# Altium project c1-12.PrjPCB (part 1 of 3)
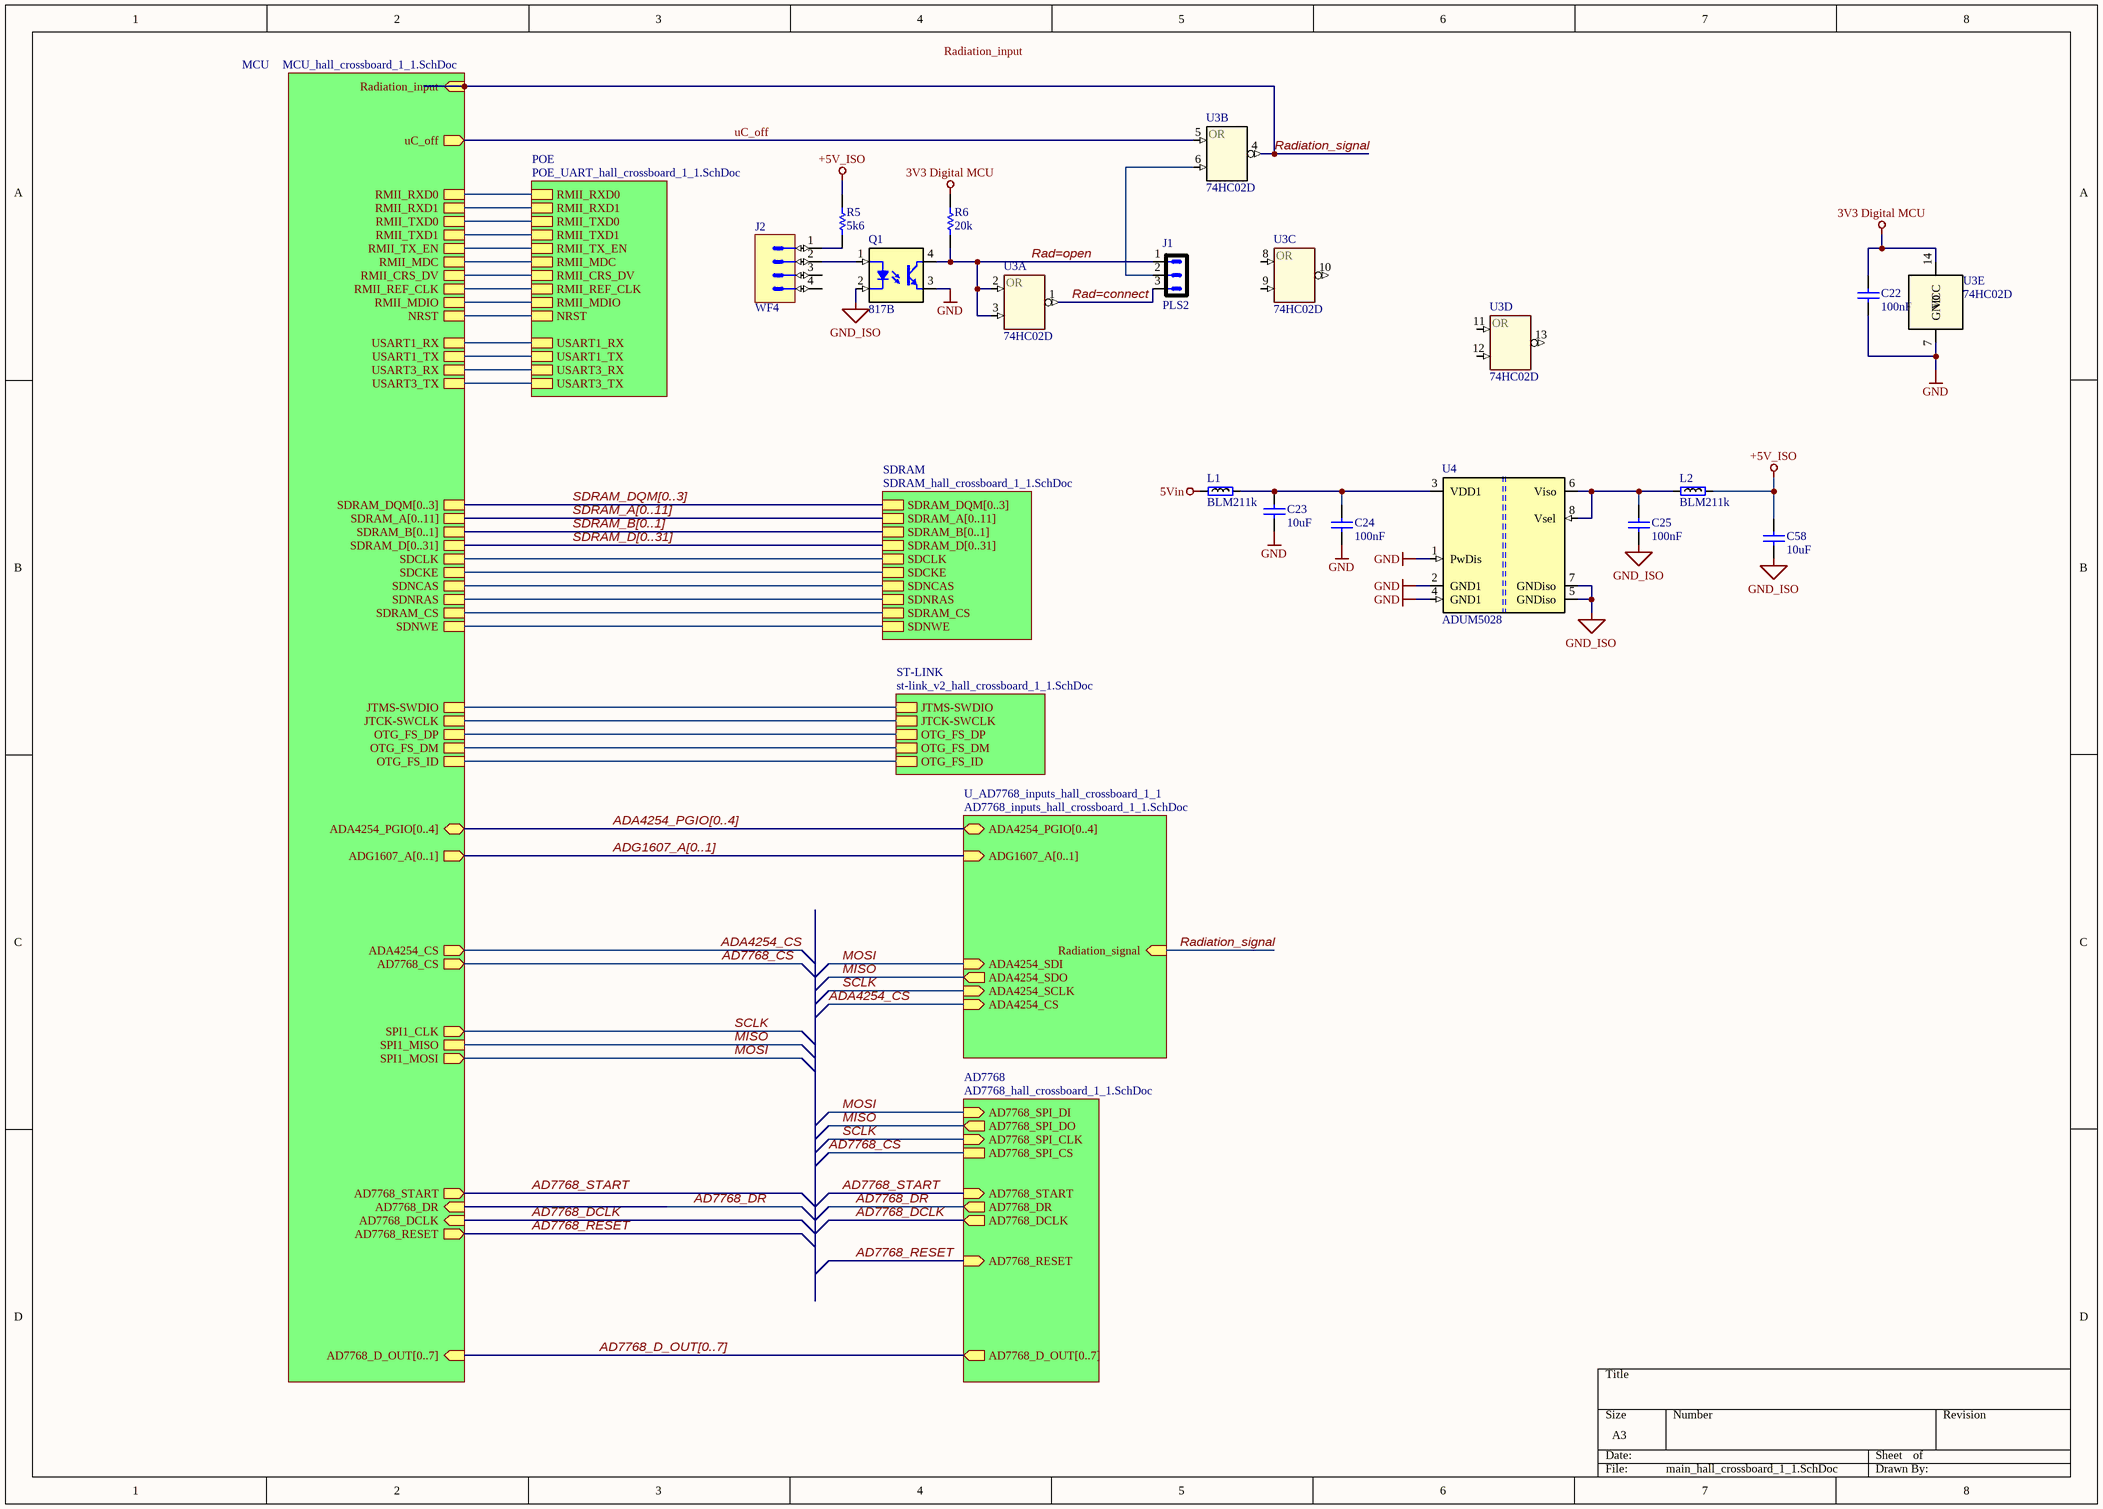
[diagram p0: main_hall_crossboard_1_1.SchDoc]
10 sheets, 646 parts. Net scope: hierarchical (ports join the sheet entries above them; power ports are global).
Board file: PCB_proj_module.PcbDoc
Sheets:
  main_hall_crossboard_1_1.SchDoc
    MCU = MCU_hall_crossboard_1_1.SchDoc
    POE = POE_UART_hall_crossboard_1_1.SchDoc
    AD7768 = AD7768_hall_crossboard_1_1.SchDoc
    ST-LINK = st-link_v2_hall_crossboard_1_1.SchDoc
    SDRAM = SDRAM_hall_crossboard_1_1.SchDoc
    U_AD7768_inputs_hall_crossboard_1_1 = AD7768_inputs_hall_crossboard_1_1.SchDoc
      meas_ch1 = one_planar_sensor_connector_hall_crossboard_1_1.SchDoc
        U_source_of_current_hall_crossboard_1_1 = source_of_current_hall_crossboard_1_1.SchDoc
      meas_ch2 = one_planar_sensor_connector_hall_crossboard_1_1.SchDoc
        U_source_of_current_hall_crossboard_1_1 = source_of_current_hall_crossboard_1_1.SchDoc
      meas_ch3 = one_planar_sensor_connector_hall_crossboard_1_1.SchDoc
        U_source_of_current_hall_crossboard_1_1 = source_of_current_hall_crossboard_1_1.SchDoc
      meas_ch4 = one_planar_sensor_connector_hall_crossboard_1_1.SchDoc
        U_source_of_current_hall_crossboard_1_1 = source_of_current_hall_crossboard_1_1.SchDoc
      meas_ch5 = one_planar_sensor_connector_hall_crossboard_1_1.SchDoc
        U_source_of_current_hall_crossboard_1_1 = source_of_current_hall_crossboard_1_1.SchDoc
      meas_ch6 = one_planar_sensor_connector_hall_crossboard_1_1.SchDoc
        U_source_of_current_hall_crossboard_1_1 = source_of_current_hall_crossboard_1_1.SchDoc
      meas_ch7 = one_planar_sensor_connector_hall_crossboard_1_1.SchDoc
        U_source_of_current_hall_crossboard_1_1 = source_of_current_hall_crossboard_1_1.SchDoc
      meas_ch8 = one_planar_sensor_connector_hall_crossboard_1_1.SchDoc
        U_source_of_current_hall_crossboard_1_1 = source_of_current_hall_crossboard_1_1.SchDoc
  power_hall_crossboard_1_1.SchDoc

## Sheet main_hall_crossboard_1_1.SchDoc
size A3

### Parts
C22  100nF  [0603C]
C23  10uF  [0805C]
C24  100nF  [0603C]
C25  100nF  [0603C]
C58  10uF  [0805C]
J1  PLS2  [COMATEL_385.0358.1.03.400]
J2  WF4  [WF4_2_54]
L1  BLM211k  [RESC2012X50N]
L2  BLM211k  [RESC2012X50N]
Q1  817B  [DIP4-300]
R5  5k6  [0603R]
R6  20k  [0603R]
U3  74HC02D  [SOIC127P600X175-14N]  (parts A,B,C,D,E of 5)
U4  ADUM5028  [SOIC127P600X175-8N]

### Sub-sheets
AD7768 = AD7768_hall_crossboard_1_1.SchDoc: AD7768_SPI_DI (in), AD7768_SPI_DO (out), AD7768_SPI_CLK (in), AD7768_SPI_CS, AD7768_DR (out), AD7768_RESET (in), AD7768_START (in), AD7768_DCLK (out), AD7768_D_OUT[0..7] (out)
MCU = MCU_hall_crossboard_1_1.SchDoc: RMII_RXD0, RMII_RXD1, RMII_TXD0, RMII_TXD1, RMII_TX_EN, RMII_MDC, RMII_CRS_DV, RMII_REF_CLK, RMII_MDIO, NRST, SPI1_CLK (out), SPI1_MISO, SPI1_MOSI (out), SDRAM_DQM[0..3], SDRAM_A[0..11], SDRAM_D[0..31], SDRAM_B[0..1], SDCLK, SDCKE, SDNCAS, SDNRAS, SDRAM_CS, SDNWE, USART1_RX, USART1_TX, USART3_RX, USART3_TX, JTMS-SWDIO, JTCK-SWCLK, OTG_FS_DP, OTG_FS_DM, OTG_FS_ID, Radiation_input (in), ADA4254_PGIO[0..4] (bidir), ADG1607_A[0..1] (out), ADA4254_CS (out), AD7768_CS (out), uC_off (out), AD7768_START (out), AD7768_DR (in), AD7768_DCLK (in), AD7768_RESET (out), AD7768_D_OUT[0..7] (in)
POE = POE_UART_hall_crossboard_1_1.SchDoc: RMII_RXD0, RMII_RXD1, RMII_TXD0, RMII_TXD1, RMII_TX_EN, RMII_MDC, RMII_CRS_DV, RMII_REF_CLK, RMII_MDIO, NRST, USART1_RX, USART1_TX, USART3_RX, USART3_TX
SDRAM = SDRAM_hall_crossboard_1_1.SchDoc: SDRAM_DQM[0..3], SDRAM_A[0..11], SDRAM_D[0..31], SDRAM_B[0..1], SDCLK, SDCKE, SDNCAS, SDNRAS, SDRAM_CS, SDNWE
ST-LINK = st-link_v2_hall_crossboard_1_1.SchDoc: JTMS-SWDIO, JTCK-SWCLK, OTG_FS_DP, OTG_FS_DM, OTG_FS_ID
U_AD7768_inputs_hall_crossboard_1_1 = AD7768_inputs_hall_crossboard_1_1.SchDoc: Radiation_signal (in), ADA4254_SDO (out), ADA4254_SDI (in), ADA4254_SCLK (in), ADA4254_CS (in), ADA4254_PGIO[0..4] (bidir), ADG1607_A[0..1] (in)

### Nets
3V3 Digital MCU: C22.2 R6.2 U3.14(VCC)
5Vin: L1.2
+5V_ISO: C58.2 L2.1 R5.2
GND: C22.1 C23.1 C24.1 Q1.3(E) U3.7(GND) U4.1(PwDis) U4.2(GND1) U4.4(GND1)  [project net Pt_100+]
GND_ISO: C25.1 C58.1 Q1.2(C) U4.5(GNDiso) U4.7(GNDiso)
AD7768_CS: sheet MCU/AD7768_CS, sheet AD7768/AD7768_SPI_CS
AD7768_DCLK: sheet MCU/AD7768_DCLK, sheet AD7768/AD7768_DCLK
AD7768_DR: sheet MCU/AD7768_DR, sheet AD7768/AD7768_DR
AD7768_RESET: sheet MCU/AD7768_RESET, sheet AD7768/AD7768_RESET
AD7768_START: sheet MCU/AD7768_START, sheet AD7768/AD7768_START
ADA4254_CS: sheet MCU/ADA4254_CS, sheet U_AD7768_inputs_hall_crossboard_1_1/ADA4254_CS
MISO: sheet MCU/SPI1_MISO, sheet AD7768/AD7768_SPI_DO, sheet U_AD7768_inputs_hall_crossboard_1_1/ADA4254_SDO
MOSI: sheet MCU/SPI1_MOSI, sheet AD7768/AD7768_SPI_DI, sheet U_AD7768_inputs_hall_crossboard_1_1/ADA4254_SDI
NRST: sheet MCU/NRST, sheet POE/NRST
Rad=connect: J1.3 U3.1(OUT)
Rad=open: J1.1 Q1.4(C) R6.1 U3.2(IN) U3.3(IN)
Radiation_signal: U3.4(OUT) ; sheet MCU/Radiation_input, sheet U_AD7768_inputs_hall_crossboard_1_1/Radiation_signal
SCLK: sheet MCU/SPI1_CLK, sheet AD7768/AD7768_SPI_CLK, sheet U_AD7768_inputs_hall_crossboard_1_1/ADA4254_SCLK
uC_off: U3.5(IN) ; sheet MCU/uC_off
NetC23_2: C23.2 C24.2 L1.1 U4.3(VDD1)
NetC25_2: C25.2 L2.2 U4.6(Viso) U4.8(Vsel)
NetCN1_2: sheet MCU/JTMS-SWDIO, sheet ST-LINK/JTMS-SWDIO
NetCN1_3: sheet MCU/JTCK-SWCLK, sheet ST-LINK/JTCK-SWCLK
NetCR2_1: sheet MCU/OTG_FS_DP, sheet ST-LINK/OTG_FS_DP
NetCR2_3: sheet MCU/OTG_FS_DM, sheet ST-LINK/OTG_FS_DM
NetDD1_7: sheet MCU/USART1_RX, sheet POE/USART1_RX
NetDD1_10: sheet MCU/USART1_TX, sheet POE/USART1_TX
NetDD2_8: sheet MCU/USART3_RX, sheet POE/USART3_RX
NetDD2_9: sheet MCU/USART3_TX, sheet POE/USART3_TX
NetJ1_2: J1.2 U3.6(IN)
NetJ2_1: J2.1 R5.1
NetJ2_2: J2.2 Q1.1(A)
NetR48_1: sheet MCU/RMII_RXD0, sheet POE/RMII_RXD0
NetR49_1: sheet MCU/RMII_RXD1, sheet POE/RMII_RXD1
NetR51_1: sheet MCU/RMII_CRS_DV, sheet POE/RMII_CRS_DV
NetR53_1: sheet MCU/RMII_MDIO, sheet POE/RMII_MDIO
NetR55_1: sheet MCU/RMII_REF_CLK, sheet POE/RMII_REF_CLK
NetU2_35: sheet MCU/SDNWE, sheet SDRAM/SDNWE
NetU2_36: sheet MCU/RMII_MDC, sheet POE/RMII_MDC
NetU2_46: sheet MCU/SDCKE, sheet SDRAM/SDCKE
NetU2_70: sheet MCU/SDNRAS, sheet SDRAM/SDNRAS
NetU2_135: sheet MCU/SDCLK, sheet SDRAM/SDCLK
NetU2_144: sheet MCU/OTG_FS_ID, sheet ST-LINK/OTG_FS_ID
NetU2_177: sheet MCU/SDRAM_CS, sheet SDRAM/SDRAM_CS
NetU2_180: sheet MCU/RMII_TX_EN, sheet POE/RMII_TX_EN
NetU2_182: sheet MCU/RMII_TXD0, sheet POE/RMII_TXD0
NetU2_183: sheet MCU/RMII_TXD1, sheet POE/RMII_TXD1
NetU2_191: sheet MCU/SDNCAS, sheet SDRAM/SDNCAS

Not connected (* = marked no-connect by the designer): J2 3 4; U3 8(IN) 9(IN) 10(OUT) 11(IN) 12(IN) 13(OUT)

### Buses and harness runs
bus AD7768_D_OUT[0..7] = sheet AD7768/AD7768_D_OUT[0..7] = sheet MCU/AD7768_D_OUT[0..7]
bus ADA4254_PGIO[0..4] = sheet MCU/ADA4254_PGIO[0..4] = sheet U_AD7768_inputs_hall_crossboard_1_1/ADA4254_PGIO[0..4]
bus ADG1607_A[0..1] = sheet MCU/ADG1607_A[0..1] = sheet U_AD7768_inputs_hall_crossboard_1_1/ADG1607_A[0..1]
bus SDRAM_A[0..11] = sheet MCU/SDRAM_A[0..11] = sheet SDRAM/SDRAM_A[0..11]
bus SDRAM_B[0..1] = sheet MCU/SDRAM_B[0..1] = sheet SDRAM/SDRAM_B[0..1]
bus SDRAM_D[0..31] = sheet MCU/SDRAM_D[0..31] = sheet SDRAM/SDRAM_D[0..31]
bus SDRAM_DQM[0..3] = sheet MCU/SDRAM_DQM[0..3] = sheet SDRAM/SDRAM_DQM[0..3]

### Notes on the sheet
- Labels drawn without touching a wire or pin: Radiation_input
- (in symbol 74HC02D, part A) OR
- (in symbol 74HC02D, part B) OR
- (in symbol 74HC02D, part C) OR
- (in symbol 74HC02D, part D) OR

### Library data of the parts
C22-C25 C58 = Capacitor_ST: Capacitor 0402 / 0603 / 0805; Revision: July-2002: Re-released for DXP Platform.
  C22 C24 C25: Value: 100nF
  C23 C58: Value: 10uF
J1 = PLS3: Vendor: Confly; SMD Solders: 0; Solder Option: RM; THD Solders: 2; Price: 1; Device: PLS2
J2 = WF4: Вилка  WF4; Vendor: Confly; SMD Solders: 0; Solder Option: RM; THD Solders: 4; Price: 20; Device: WF4
L1 L2 = BLM21: SMD Ferrite bead 0805; Vendor: Vishay; Value: 1k; Pkg: SMD0805; SMD Solders: 2; Solder Option: RM; Device: BLM21; Price: 10
Q1 = 817B: Optotransistor; Pkg: DIP4; SMD Solders: 0; Solder Option: RM; THD Solders: 4; Vendor: UMW; Voltage: 35V; Device: 817B; Price: 10; Name to order: 817B; Current: 0
R5 R6 = Resistor_ST: Resistor 0402 / 0603 / 0805 c2
  R5: Value: 5k6
  R6: Value: 20k
U3 = 74HC02D: 4 лог. элемента 2ИЛИ-НЕ; Vendor: NXP; Pkg: SOIC14; SMD Solders: 14; Solder Option: RM; Voltage: 2.. 6V; Price: 50; Device: 74HC02D; Name to order: 74HC02D
U4 = ADUM5028: Isolateted DC DC 5V->5V or 3V3 60mA; Vendor: Analog Devoces; Pkg: SOIC8; SMD Solders: 8; Solder Option: RM; Name to order: ADuM5028-5BRIZ; Current: 200; Price: 2500; Device: ADUM5028

## Sheet MCU_hall_crossboard_1_1.SchDoc
size A3
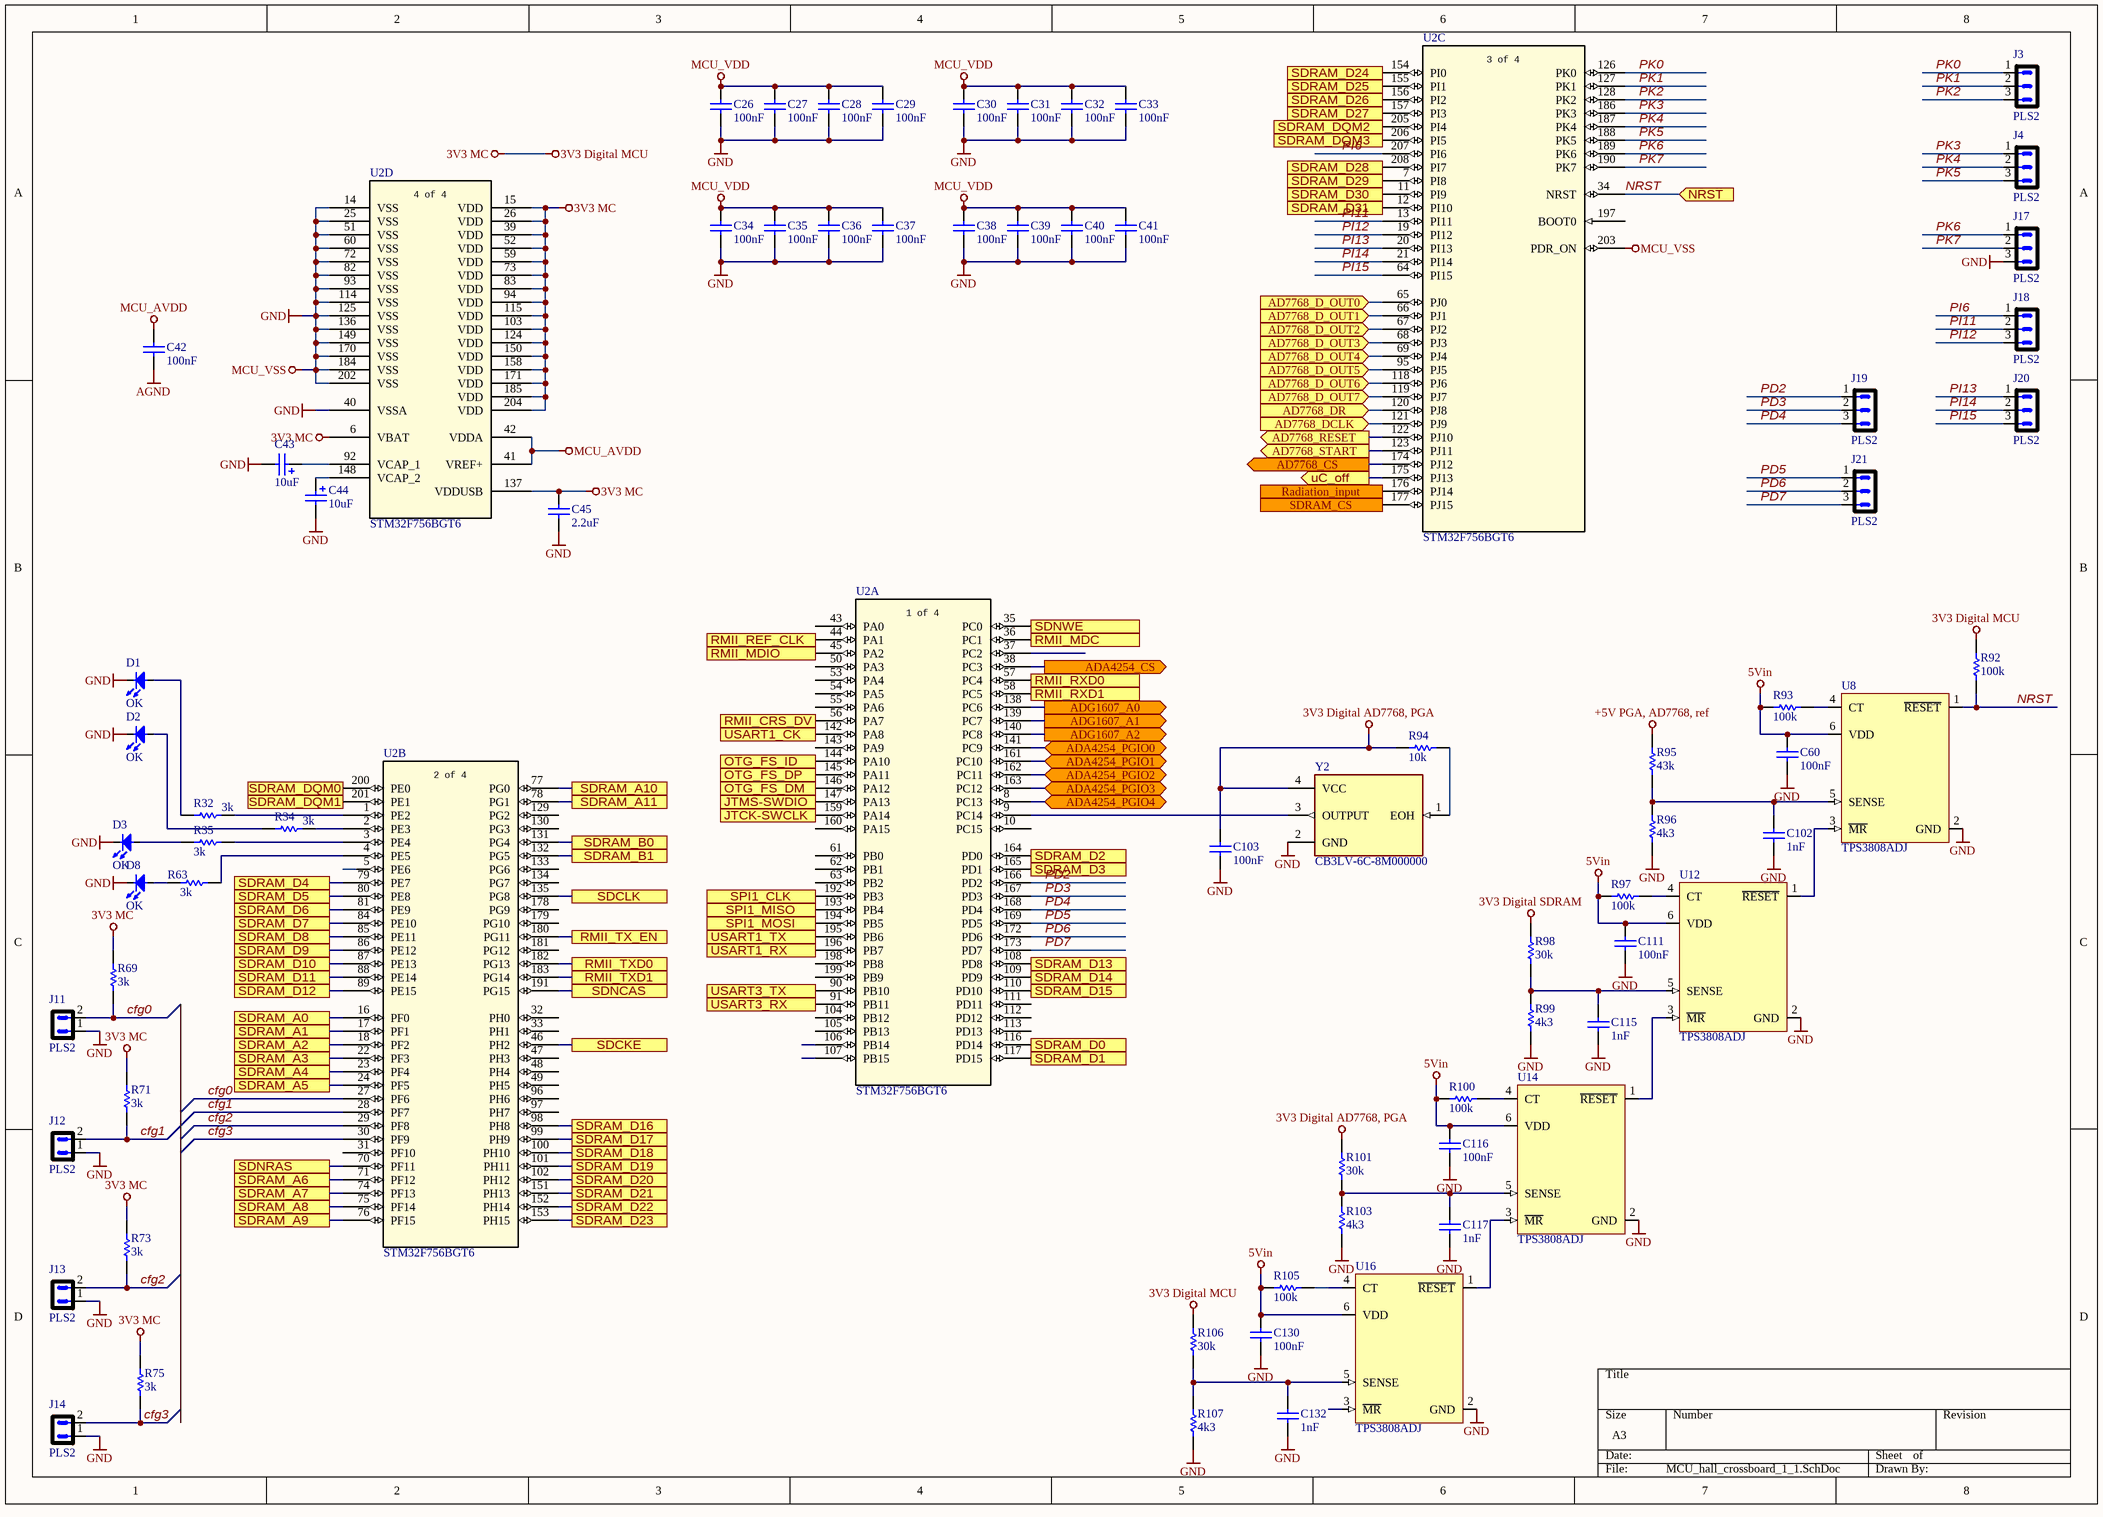
[diagram p1: MCU_hall_crossboard_1_1.SchDoc]

### Parts
C26  100nF  [0603C]
C27  100nF  [0603C]
C28  100nF  [0603C]
C29  100nF  [0603C]
C30  100nF  [0603C]
C31  100nF  [0603C]
C32  100nF  [0603C]
C33  100nF  [0603C]
C34  100nF  [0603C]
C35  100nF  [0603C]
C36  100nF  [0603C]
C37  100nF  [0603C]
C38  100nF  [0603C]
C39  100nF  [0603C]
C40  100nF  [0603C]
C41  100nF  [0603C]
C42  100nF  [0603C]
C43  10uF  [0805C]
C44  10uF  [0805C]
C45  2.2uF  [0805C]
C60  100nF  [0603C]
C102  1nF  [0603C]
C103  100nF  [0603C]
C111  100nF  [0603C]
C115  1nF  [0603C]
C116  100nF  [0603C]
C117  1nF  [0603C]
C130  100nF  [0603C]
C132  1nF  [0603C]
D1  OK  [LED0603]
D2  OK  [LED0603]
D3  OK  [LED0603]
D8  OK  [LED0603]
J3  PLS2  [COMATEL_385.0358.1.03.400]
J4  PLS2  [COMATEL_385.0358.1.03.400]
J11  PLS2  [SAMTEC_TSW-102-23-L-S]
J12  PLS2  [SAMTEC_TSW-102-23-L-S]
J13  PLS2  [SAMTEC_TSW-102-23-L-S]
J14  PLS2  [SAMTEC_TSW-102-23-L-S]
J17  PLS2  [COMATEL_385.0358.1.03.400]
J18  PLS2  [COMATEL_385.0358.1.03.400]
J19  PLS2  [COMATEL_385.0358.1.03.400]
J20  PLS2  [COMATEL_385.0358.1.03.400]
J21  PLS2  [COMATEL_385.0358.1.03.400]
R32  3k  [0603R]
R34  3k  [0603R]
R35  3k  [0603R]
R63  3k  [0603R]
R69  3k  [0603R]
R71  3k  [0603R]
R73  3k  [0603R]
R75  3k  [0603R]
R92  100k  [0805R]
R93  100k  [0805R]
R94  10k  [0805R]
R95  43k  [0805R]
R96  4k3  [0805R]
R97  100k  [0805R]
R98  30k  [0805R]
R99  4k3  [0805R]
R100  100k  [0805R]
R101  30k  [0805R]
R103  4k3  [0805R]
R105  100k  [0805R]
R106  30k  [0805R]
R107  4k3  [0805R]
U2  STM32F756BGT6  [QFP50P3000X3000X160-208N]  (parts A,B,C,D of 4)
U8  TPS3808ADJ  [SOT95P270X145-6N]
U12  TPS3808ADJ  [SOT95P270X145-6N]
U14  TPS3808ADJ  [SOT95P270X145-6N]
U16  TPS3808ADJ  [SOT95P270X145-6N]
Y2  CB3LV-6C-8M000000  [OSC_CB3LV-6C-8M000000]

### Ports
AD7768_CS (out), AD7768_D_OUT0 (in), AD7768_D_OUT1 (in), AD7768_D_OUT2 (in), AD7768_D_OUT3 (in), AD7768_D_OUT4 (in), AD7768_D_OUT5 (in), AD7768_D_OUT6 (in), AD7768_D_OUT7 (in), AD7768_DCLK (in), AD7768_DR (in), AD7768_RESET (out), AD7768_START (out), ADA4254_CS (out), ADA4254_PGIO0 (bidir), ADA4254_PGIO1 (bidir), ADA4254_PGIO2 (bidir), ADA4254_PGIO3 (bidir), ADA4254_PGIO4 (bidir), ADG1607_A0 (out), ADG1607_A1 (out), ADG1607_A2 (out), JTCK-SWCLK, JTMS-SWDIO, NRST (in), OTG_FS_DM, OTG_FS_DP, OTG_FS_ID, Radiation_input (in), RMII_CRS_DV, RMII_MDC, RMII_MDIO, RMII_REF_CLK, RMII_RXD0, RMII_RXD1, RMII_TX_EN, RMII_TXD0, RMII_TXD1, SDCKE, SDCLK, SDNCAS, SDNRAS, SDNWE, SDRAM_A0, SDRAM_A1, SDRAM_A2, SDRAM_A3, SDRAM_A4, SDRAM_A5, SDRAM_A6, SDRAM_A7, SDRAM_A8, SDRAM_A9, SDRAM_A10, SDRAM_A11, SDRAM_B0, SDRAM_B1, SDRAM_CS (out), SDRAM_D0, SDRAM_D1, SDRAM_D2, SDRAM_D3, SDRAM_D4, SDRAM_D5, SDRAM_D6, SDRAM_D7, SDRAM_D8, SDRAM_D9, SDRAM_D10, SDRAM_D11, SDRAM_D12, SDRAM_D13, SDRAM_D14, SDRAM_D15, SDRAM_D16, SDRAM_D17, SDRAM_D18, SDRAM_D19, SDRAM_D20, SDRAM_D21, SDRAM_D22, SDRAM_D23, SDRAM_D24, SDRAM_D25, SDRAM_D26, SDRAM_D27, SDRAM_D28, SDRAM_D29, SDRAM_D30, SDRAM_D31, SDRAM_DQM0, SDRAM_DQM1, SDRAM_DQM2, SDRAM_DQM3, SPI1_CLK, SPI1_MISO, SPI1_MOSI, uC_off (out), USART1_CK, USART1_RX, USART1_TX, USART3_RX, USART3_TX

### Nets
3V3 Digital AD7768, PGA: C103.1 R94.1 R101.2 Y2.4(VCC)
3V3 Digital MCU: C45.2 R69.2 R71.2 R73.2 R75.2 R92.2 R106.2 U2.6(VBAT) U2.15(VDD) U2.26(VDD) U2.39(VDD) U2.52(VDD) U2.59(VDD) U2.73(VDD) U2.83(VDD) U2.94(VDD) U2.103(VDD) U2.115(VDD) U2.124(VDD) U2.137(VDDUSB) U2.150(VDD) U2.158(VDD) U2.171(VDD) U2.185(VDD) U2.204(VDD)  [also labelled 3V3 MC]
3V3 Digital SDRAM: R98.2
5Vin: C60.2 C111.2 C116.2 C130.2 R93.1 R97.1 R100.1 R105.1 U8.6(VDD) U12.6(VDD) U14.6(VDD) U16.6(VDD)
+5V PGA, AD7768, ref: R95.2
AGND: C42.1
GND: C26.1 C27.1 C28.1 C29.1 C30.1 C31.1 C32.1 C33.1 C34.1 C35.1 C36.1 C37.1 C38.1 C39.1 C40.1 C41.1 C43.2 C44.2 C45.1 C60.1 C102.1 C103.2 C111.1 C115.1 C116.1 C117.1 C130.1 C132.1 D1.1(C) D2.1(C) D3.1(C) D8.1(C) J11.1 J12.1 J13.1 J14.1 J17.3 R96.1 R99.1 R103.1 R107.1 U2.14(VSS) U2.25(VSS) U2.40(VSSA) U2.51(VSS) U2.60(VSS) U2.72(VSS) U2.82(VSS) U2.93(VSS) U2.114(VSS) U2.125(VSS) U2.136(VSS) U2.149(VSS) U2.170(VSS) U2.184(VSS) U2.202(VSS) U2.203(PDR_ON) U8.2(GND) U12.2(GND) U14.2(GND) U16.2(GND) Y2.2(GND)  [also labelled MCU_VSS]  [project net Pt_100+]
MCU_AVDD: C42.2 U2.41(VREF+) U2.42(VDDA)
MCU_VDD: C26.2 C27.2 C28.2 C29.2 C30.2 C31.2 C32.2 C33.2 C34.2 C35.2 C36.2 C37.2 C38.2 C39.2 C40.2 C41.2
AD7768_CS: U2.174(PJ12) ; port AD7768_CS
AD7768_DCLK: U2.121(PJ9) ; port AD7768_DCLK
AD7768_DR: U2.120(PJ8) ; port AD7768_DR
AD7768_RESET: U2.122(PJ10) ; port AD7768_RESET
AD7768_START: U2.123(PJ11) ; port AD7768_START
ADA4254_CS: U2.38(PC3) ; port ADA4254_CS
cfg0: J11.2 R69.1 U2.27(PF6)
cfg1: J12.2 R71.1 U2.28(PF7)
cfg2: J13.2 R73.1 U2.29(PF8)
cfg3: J14.2 R75.1 U2.30(PF9)
MISO: U2.193(PB4) ; port SPI1_MISO
MOSI: U2.194(PB5) ; port SPI1_MOSI
NRST: R92.1 U2.34(NRST) U8.1(~{RESET}) ; port NRST
PD2: J19.1 U2.166(PD2)
PD3: J19.2 U2.167(PD3)
PD4: J19.3 U2.168(PD4)
PD5: J21.1 U2.169(PD5)
PD6: J21.2 U2.172(PD6)
PD7: J21.3 U2.173(PD7)
PI6: J18.1 U2.207(PI6)
PI11: J18.2 U2.13(PI11)
PI12: J18.3 U2.19(PI12)
PI13: J20.1 U2.20(PI13)
PI14: J20.2 U2.21(PI14)
PI15: J20.3 U2.64(PI15)
PK0: J3.1 U2.126(PK0)
PK1: J3.2 U2.127(PK1)
PK2: J3.3 U2.128(PK2)
PK3: J4.1 U2.186(PK3)
PK4: J4.2 U2.187(PK4)
PK5: J4.3 U2.188(PK5)
PK6: J17.1 U2.189(PK6)
PK7: J17.2 U2.190(PK7)
Radiation_signal: U2.176(PJ14) ; port Radiation_input
SCLK: U2.192(PB3) ; port SPI1_CLK
uC_off: U2.175(PJ13) ; port uC_off
NetC43_1: C43.1 U2.92(VCAP_1)
NetC44_1: C44.1 U2.148(VCAP_2)
NetC102_2: C102.2 R95.1 R96.2 U8.5(SENSE)
NetC115_2: C115.2 R98.1 R99.2 U12.5(SENSE)
NetC117_2: C117.2 R101.1 R103.2 U14.5(SENSE)
NetC132_2: C132.2 R106.1 R107.2 U16.5(SENSE)
NetCN1_2: U2.147(PA13) ; port JTMS-SWDIO
NetCN1_3: U2.159(PA14) ; port JTCK-SWCLK
NetCR2_1: U2.145(PA11) ; port OTG_FS_DP
NetCR2_3: U2.146(PA12) ; port OTG_FS_DM
NetD1_2: D1.2(A) R32.1
NetD2_2: D2.2(A) R34.1
NetD3_2: D3.2(A) R35.1
NetD8_2: D8.2(A) R63.1
NetDD1_7: U2.196(PB7) ; port USART1_RX
NetDD1_10: U2.195(PB6) ; port USART1_TX
NetDD2_8: U2.91(PB11) ; port USART3_RX
NetDD2_9: U2.90(PB10) ; port USART3_TX
NetR32_2: R32.2 U2.1(PE2)
NetR34_2: R34.2 U2.2(PE3)
NetR35_2: R35.2 U2.3(PE4)
NetR48_1: U2.57(PC4) ; port RMII_RXD0
NetR49_1: U2.58(PC5) ; port RMII_RXD1
NetR51_1: U2.56(PA7) ; port RMII_CRS_DV
NetR53_1: U2.45(PA2) ; port RMII_MDIO
NetR55_1: U2.44(PA1) ; port RMII_REF_CLK
NetR63_2: R63.2 U2.4(PE5)
NetR93_2: R93.2 U8.4(CT)
NetR94_2: R94.2 Y2.1(EOH)
NetR97_2: R97.2 U12.4(CT)
NetR100_2: R100.2 U14.4(CT)
NetR105_2: R105.2 U16.4(CT)
NetU2_7: U2.7(PI8) ; port SDRAM_D29
NetU2_8: U2.8(PC13) ; port ADA4254_PGIO4
NetU2_9: U2.9(PC14) Y2.3(OUTPUT)
NetU2_11: U2.11(PI9) ; port SDRAM_D30
NetU2_12: U2.12(PI10) ; port SDRAM_D31
NetU2_16: U2.16(PF0) ; port SDRAM_A0
NetU2_17: U2.17(PF1) ; port SDRAM_A1
NetU2_18: U2.18(PF2) ; port SDRAM_A2
NetU2_22: U2.22(PF3) ; port SDRAM_A3
NetU2_23: U2.23(PF4) ; port SDRAM_A4
NetU2_24: U2.24(PF5) ; port SDRAM_A5
NetU2_35: U2.35(PC0) ; port SDNWE
NetU2_36: U2.36(PC1) ; port RMII_MDC
NetU2_46: U2.46(PH2) ; port SDCKE
NetU2_65: U2.65(PJ0) ; port AD7768_D_OUT0
NetU2_66: U2.66(PJ1) ; port AD7768_D_OUT1
NetU2_67: U2.67(PJ2) ; port AD7768_D_OUT2
NetU2_68: U2.68(PJ3) ; port AD7768_D_OUT3
NetU2_69: U2.69(PJ4) ; port AD7768_D_OUT4
NetU2_70: U2.70(PF11) ; port SDNRAS
NetU2_71: U2.71(PF12) ; port SDRAM_A6
NetU2_74: U2.74(PF13) ; port SDRAM_A7
NetU2_75: U2.75(PF14) ; port SDRAM_A8
NetU2_76: U2.76(PF15) ; port SDRAM_A9
NetU2_77: U2.77(PG0) ; port SDRAM_A10
NetU2_78: U2.78(PG1) ; port SDRAM_A11
NetU2_79: U2.79(PE7) ; port SDRAM_D4
NetU2_80: U2.80(PE8) ; port SDRAM_D5
NetU2_81: U2.81(PE9) ; port SDRAM_D6
NetU2_84: U2.84(PE10) ; port SDRAM_D7
NetU2_85: U2.85(PE11) ; port SDRAM_D8
NetU2_86: U2.86(PE12) ; port SDRAM_D9
NetU2_87: U2.87(PE13) ; port SDRAM_D10
NetU2_88: U2.88(PE14) ; port SDRAM_D11
NetU2_89: U2.89(PE15) ; port SDRAM_D12
NetU2_95: U2.95(PJ5) ; port AD7768_D_OUT5
NetU2_98: U2.98(PH8) ; port SDRAM_D16
NetU2_99: U2.99(PH9) ; port SDRAM_D17
NetU2_100: U2.100(PH10) ; port SDRAM_D18
NetU2_101: U2.101(PH11) ; port SDRAM_D19
NetU2_102: U2.102(PH12) ; port SDRAM_D20
NetU2_108: U2.108(PD8) ; port SDRAM_D13
NetU2_109: U2.109(PD9) ; port SDRAM_D14
NetU2_110: U2.110(PD10) ; port SDRAM_D15
NetU2_116: U2.116(PD14) ; port SDRAM_D0
NetU2_117: U2.117(PD15) ; port SDRAM_D1
NetU2_118: U2.118(PJ6) ; port AD7768_D_OUT6
NetU2_119: U2.119(PJ7) ; port AD7768_D_OUT7
NetU2_131: U2.131(PG4) ; port SDRAM_B0
NetU2_132: U2.132(PG5) ; port SDRAM_B1
NetU2_135: U2.135(PG8) ; port SDCLK
NetU2_138: U2.138(PC6) ; port ADG1607_A0
NetU2_139: U2.139(PC7) ; port ADG1607_A1
NetU2_140: U2.140(PC8) ; port ADG1607_A2
NetU2_141: U2.141(PC9) ; port ADA4254_PGIO0
NetU2_142: U2.142(PA8) ; port USART1_CK
NetU2_144: U2.144(PA10) ; port OTG_FS_ID
NetU2_151: U2.151(PH13) ; port SDRAM_D21
NetU2_152: U2.152(PH14) ; port SDRAM_D22
NetU2_153: U2.153(PH15) ; port SDRAM_D23
NetU2_154: U2.154(PI0) ; port SDRAM_D24
NetU2_155: U2.155(PI1) ; port SDRAM_D25
NetU2_156: U2.156(PI2) ; port SDRAM_D26
NetU2_157: U2.157(PI3) ; port SDRAM_D27
NetU2_161: U2.161(PC10) ; port ADA4254_PGIO1
NetU2_162: U2.162(PC11) ; port ADA4254_PGIO2
NetU2_163: U2.163(PC12) ; port ADA4254_PGIO3
NetU2_164: U2.164(PD0) ; port SDRAM_D2
NetU2_165: U2.165(PD1) ; port SDRAM_D3
NetU2_177: U2.177(PJ15) ; port SDRAM_CS
NetU2_180: U2.180(PG11) ; port RMII_TX_EN
NetU2_182: U2.182(PG13) ; port RMII_TXD0
NetU2_183: U2.183(PG14) ; port RMII_TXD1
NetU2_191: U2.191(PG15) ; port SDNCAS
NetU2_200: U2.200(PE0) ; port SDRAM_DQM0
NetU2_201: U2.201(PE1) ; port SDRAM_DQM1
NetU2_205: U2.205(PI4) ; port SDRAM_DQM2
NetU2_206: U2.206(PI5) ; port SDRAM_DQM3
NetU2_208: U2.208(PI7) ; port SDRAM_D28
NetU8_3: U8.3(~{MR}) U12.1(~{RESET})
NetU12_3: U12.3(~{MR}) U14.1(~{RESET})
NetU14_3: U14.3(~{MR}) U16.1(~{RESET})

Not connected (* = marked no-connect by the designer): U2 5(PE6) 10(PC15) 31(PF10) 32(PH0) 33(PH1) 37(PC2) 43(PA0) 47(PH3) 48(PH4) 49(PH5) 50(PA3) 53(PA4) 54(PA5) 55(PA6) 61(PB0) 62(PB1) 63(PB2) 96(PH6) 97(PH7) 104(PB12) 105(PB13) 106(PB14) 107(PB15) 111(PD11) 112(PD12) 113(PD13) 129(PG2) 130(PG3) 133(PG6) 134(PG7) 143(PA9) 160(PA15) 178(PG9) 179(PG10) 181(PG12) 197(BOOT0) 198(PB8) 199(PB9); U16 3(~{MR})

### Notes on the sheet
- (in symbol STM32F756BGT6, part A) 1 of 4
- (in symbol STM32F756BGT6, part B) 2 of 4
- (in symbol STM32F756BGT6, part C) 3 of 4
- (in symbol STM32F756BGT6, part D) 4 of 4

### Library data of the parts
C26-C42 C45 C60 C103 C111 C116 C130 = Capacitor_ST: Capacitor 0402 / 0603 / 0805; Revision: July-2002: Re-released for DXP Platform.
  C26-C42 C60 C103 C111 C116 C130: Value: 100nF
  C45: Value: 2.2uF
C43 C44 = Cap_10uF_POL_10%_TANA: Polarized Capacitor,10uF,10V,10%,typeA,VISHAY; Manuf_Part_1: 293D106X9010A2TE3; Revision: July-2002: Re-released for DXP Platform.; Value: 10uF; Manuf_1: VISHAY; Order: *; ECCN_US/EU: n/a
C102 C115 C117 C132 = Capacitor_ST: Capacitor 0402 / 0603 / 0805; Value: 100nF; Revision: July-2002: Re-released for DXP Platform.
D1-D3 D8 = LED0603: Чип светодиод 0603; Vendor: KB; SMD Solders: 2; Solder Option: RM; Pkg: SMD0603; Price: 10; Value: OK; Device: LED0603
J3 J4 J17-J21 = PLS3: as J1 on sheet main_hall_crossboard_1_1; Price: 1; Device: PLS2
J11-J14 = PLS2: Vendor: Confly; SMD Solders: 0; Solder Option: RM; THD Solders: 2; Price: 1; Device: PLS2
R32 R34 R35 R63 R69 R71 R73 R75 R92 R93 R96-R101 R103 R105-R107 = Resistor_ST: Resistor 0402 / 0603 / 0805
  R32 R34 R35 R63 R69 R71 R73 R75: Value: 3k
  R92 R93 R97 R100 R105: Value: 100k
  R96 R99 R103 R107: Value: 4k3
  R98 R101 R106: Value: 30k
R94 = Resistor_ST: Resistor 0402 / 0603 / 0805 c2; Value: 10k
R95 = Resistor_ST: Resistor 0402 / 0603 / 0805; Value: 10K
U2 = STM32F756BGT6: No Description Available; Mfr_Name: STMicroelectronics; RefDes: RefDes; Type: Type
U8 U12 U14 U16 = TPS3808: Supervisory Circuit. Low-Quiescent-Current, Programmable-Delay; Vendor: Texas Instruments; Value: ADJ; Pkg: SOT23-6; SMD Solders: 6; Solder Option: RM; THD Solders: 0; Name to order: TPS3808G01DBV; Current: 6uA; thVoltage: 400mV; Price: 200; Device: TPS3808
Y2 = CB3LV-6C-8M000000: 8 MHz XO (Standard) HCMOS, TTL Oscillator 3.3V Enable/Disable 4-SMD, No Lead; MF: CTS-Frequency Controls; SnapEDA_Link: https://www.snapeda.com/parts/CB3LV-6C-8M000000/CTS-Frequency+Controls/view-part/?ref=snap; Package: NON STANDARD-4 CTS; Value: *; MP: CB3LV-6C-8M000000; Check_prices: https://www.snapeda.com/parts/CB3LV-6C-8M000000/CTS-Frequency+Controls/view-part/?ref=eda

## Sheet POE_UART_hall_crossboard_1_1.SchDoc
size A3
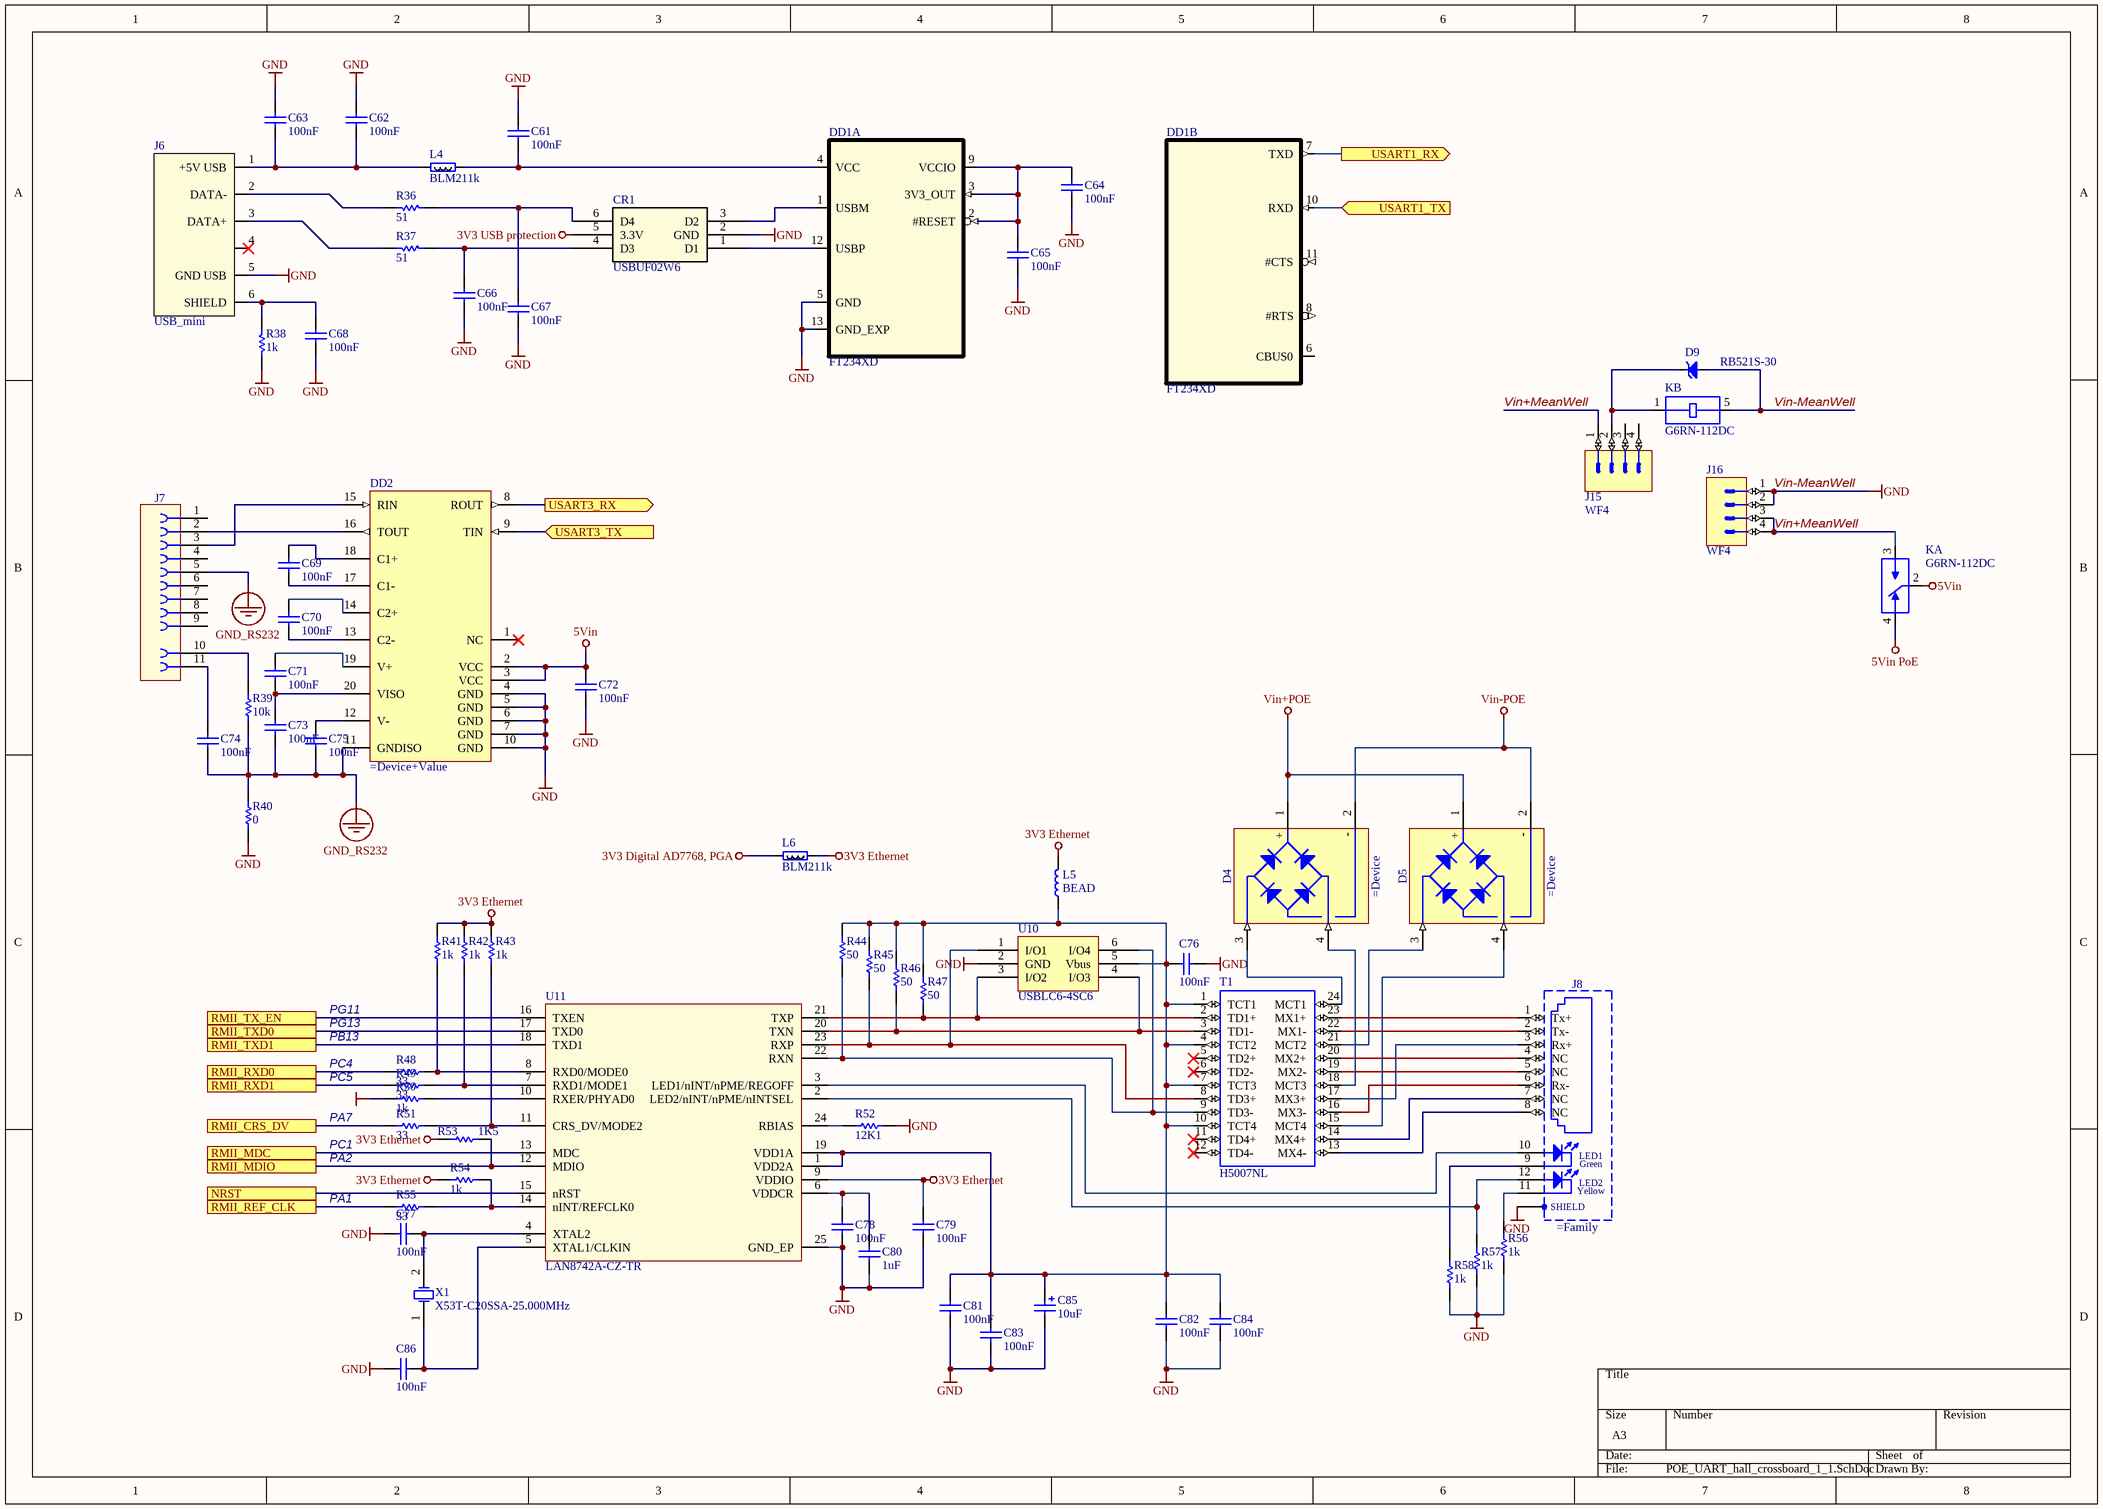
[diagram p2: POE_UART_hall_crossboard_1_1.SchDoc]

### Parts
C61  100nF  [0603C]
C62  100nF  [0603C]
C63  100nF  [0603C]
C64  100nF  [0603C]
C65  100nF  [0603C]
C66  100nF  [0603C]
C67  100nF  [0603C]
C68  100nF  [0603C]
C69  100nF  [0603C]
C70  100nF  [0603C]
C71  100nF  [0603C]
C72  100nF  [0603C]
C73  100nF  [0603C]
C74  100nF  [0603C]
C75  100nF  [0603C]
C76  100nF  [0603C]
C77  100nF  [0603C]
C78  100nF  [0603C]
C79  100nF  [0603C]
C80  1uF  [0805C]
C81  100nF  [0603C]
C82  100nF  [0603C]
C83  100nF  [0603C]
C84  100nF  [0603C]
C85  10uF  [0805C]
C86  100nF  [0603C]
CR1  USBUF02W6  [SOTT323-6L_STM-M]
D4  (no value)
D5  (no value)
D9  RB521S-30  [SODFL1608X65N]
DD1  FT234XD  [DFN_12-045]  (parts A,B of 2)
DD2  (no value)  [SOIC127P1032X265-20N]
J6  USB_mini  [TYCO_1734035-1]
J7  (no value)  [TYCO_5747844-5]
J8  (no value)  [AMPHENOL_RJHSE-5381]
J15  WF4  [WF4_2_54]
J16  WF4  [WF4_2_54]
K  G6RN-112DC  [RELAY_G6RN-1_12DC]  (parts A,B of 2)
L4  BLM211k  [RESC2012X50N]
L5  BEAD  [0603L]
L6  BLM211k  [RESC2012X50N]
R36  51  [0603R]
R37  51  [0603R]
R38  1k  [0603R]
R39  10k  [0603R]
R40  0  [0603R]
R41  1k  [0603R]
R42  1k  [0603R]
R43  1k  [0603R]
R44  50  [0603R]
R45  50  [0603R]
R46  50  [0603R]
R47  50  [0603R]
R48  33  [0603R]
R49  33  [0603R]
R50  1k  [0603R]
R51  33  [0603R]
R52  12K1  [0603R]
R53  1K5  [0603R]
R54  1k  [0603R]
R55  33  [0603R]
R56  1k  [0603R]
R57  1k  [0603R]
R58  1k  [0603R]
T1  H5007NL  [SOIC127P1600X551-24N]
U10  USBLC6-4SC6  [SOT23-6L]
U11  LAN8742A-CZ-TR  [QFN24_0R5_4X4]
X1  X53T-C20SSA-25.000MHz  [XTAL_2SM_5R0X3R2]

### Ports
NRST, RMII_CRS_DV, RMII_MDC, RMII_MDIO, RMII_REF_CLK, RMII_RXD0, RMII_RXD1, RMII_TX_EN, RMII_TXD0, RMII_TXD1, USART1_RX (out), USART1_TX (in), USART3_RX (out), USART3_TX (in)

### Nets
3V3 Digital AD7768, PGA: L6.2
3V3 Ethernet: C79.2 L5.2 L6.1 R41.2 R42.2 R43.2 R53.2 R54.1 U11.9(VDDIO)
3V3 USB protection: CR1.5(3.3V)
5Vin: C72.2 DD2.2(VCC) DD2.3(VCC) K.2(COM)
5Vin PoE: K.4(NC)
GND: C61.2 C62.2 C63.2 C64.1 C65.1 C66.2 C67.1 C68.1 C72.1 C76.1 C77.2 C78.1 C79.1 C80.1 C81.1 C82.1 C83.1 C84.1 C85.2 C86.2 CR1.2(GND) D9.2(A) DD1.5(GND) DD1.13(GND_EXP) DD2.4(GND) DD2.5(GND) DD2.6(GND) DD2.7(GND) DD2.10(GND) J6.5(GND_USB) J8.SHIELD J16.1 J16.2 K.5(COIL2) R38.1 R40.2 R50.1 R52.2 R56.1 R57.1 R58.1 U10.2(GND) U11.25(GND_EP)  [also labelled Vin-MeanWell]  [project net Pt_100+]
GND_RS232: C73.1 C74.1 C75.1 DD2.11(GNDISO) J7.5 R39.2 R40.1
Vin+POE: D4.1(+) D5.1(+)
Vin-POE: D4.2(-) D5.2(-)
NRST: U11.15(nRST) ; port NRST
Vin+MeanWell: J15.1 J16.3 J16.4 K.3(NO)
NetC61_1: C61.1 DD1.4(VCC) L4.1
NetC62_1: C62.1 C63.1 J6.1(+5V_USB) L4.2
NetC64_2: C64.2 C65.2 DD1.2(#RESET) DD1.3(3V3_OUT) DD1.9(VCCIO)
NetC66_1: C66.1 CR1.4(D3) R37.1
NetC67_2: C67.2 CR1.6(D4) R36.1
NetC68_2: C68.2 J6.6(SHIELD) R38.2
NetC69_1: C69.1 DD2.17(C1-)
NetC69_2: C69.2 DD2.18(C1+)
NetC70_1: C70.1 DD2.13(C2-)
NetC70_2: C70.2 DD2.14(C2+)
NetC71_1: C71.1 C73.2 DD2.20(VISO)
NetC71_2: C71.2 DD2.19(V+)
NetC74_2: C74.2 J7.11
NetC75_2: C75.2 DD2.12(V-)
NetC76_2: C76.2 C81.2 C82.2 C83.2 C84.2 C85.1 L5.1 R44.2 R45.2 R46.2 R47.2 T1.1(TCT1) T1.4(TCT2) T1.7(TCT3) T1.10(TCT4) U10.5(Vbus) U11.1(VDD2A) U11.19(VDD1A)
NetC77_1: C77.1 U11.4(XTAL2) X1.2(OSC2)
NetC78_2: C78.2 C80.2 U11.6(VDDCR)
NetC86_1: C86.1 U11.5(XTAL1/CLKIN) X1.1(OSC1)
NetCR1_1: CR1.1(D1) DD1.12(USBP)
NetCR1_3: CR1.3(D2) DD1.1(USBM)
NetD4_3: D4.3(AC) T1.24(MCT1)
NetD4_4: D4.4(AC) T1.18(MCT3)
NetD5_3: D5.3(AC) T1.21(MCT2)
NetD5_4: D5.4(AC) T1.15(MCT4)
NetD9_1: D9.1(C) J15.2 K.1(COIL1)
NetDD1_7: DD1.7(TXD) ; port USART1_RX
NetDD1_10: DD1.10(RXD) ; port USART1_TX
NetDD2_8: DD2.8(ROUT) ; port USART3_RX
NetDD2_9: DD2.9(TIN) ; port USART3_TX
NetDD2_15: DD2.15(RIN) J7.3
NetDD2_16: DD2.16(TOUT) J7.2
NetJ6_2: J6.2(DATA-) R36.2
NetJ6_3: J6.3(DATA+) R37.2
NetJ7_10: J7.10 R39.1
NetJ8_1: J8.1(Tx+) T1.23(MX1+)
NetJ8_2: J8.2(Tx-) T1.22(MX1-)
NetJ8_3: J8.3(Rx+) T1.17(MX3+)
NetJ8_4: J8.4(NC) T1.20(MX2+)
NetJ8_5: J8.5(NC) T1.19(MX2-)
NetJ8_6: J8.6(Rx-) T1.16(MX3-)
NetJ8_7: J8.7(NC) T1.14(MX4+)
NetJ8_8: J8.8(NC) T1.13(MX4-)
NetJ8_9: J8.9(CLED1) R58.2
NetJ8_10: J8.10(ALED1) U11.3(LED1/nINT/nPME/REGOFF)
NetJ8_11: J8.11(ALED2) R56.2
NetJ8_12: J8.12(CLED2) R57.2 U11.2(LED2/nINT/nPME/nINTSEL)
NetR41_1: R41.1 R48.2 U11.8(RXD0/MODE0)
NetR42_1: R42.1 R49.2 U11.7(RXD1/MODE1)
NetR43_1: R43.1 R51.2 U11.11(CRS_DV/MODE2)
NetR44_1: R44.1 T1.9(TD3-) U10.6(I/O4) U11.22(RXN)
NetR45_1: R45.1 T1.8(TD3+) U10.1(I/O1) U11.23(RXP)
NetR46_1: R46.1 T1.3(TD1-) U10.4(I/O3) U11.20(TXN)
NetR47_1: R47.1 T1.2(TD1+) U10.3(I/O2) U11.21(TXP)
NetR48_1: R48.1 ; port RMII_RXD0
NetR49_1: R49.1 ; port RMII_RXD1
NetR50_2: R50.2 U11.10(RXER/PHYAD0)
NetR51_1: R51.1 ; port RMII_CRS_DV
NetR52_1: R52.1 U11.24(RBIAS)
NetR53_1: R53.1 U11.12(MDIO) ; port RMII_MDIO
NetR54_2: R54.2 R55.2 U11.14(nINT/REFCLK0)
NetR55_1: R55.1 ; port RMII_REF_CLK
NetU2_36: U11.13(MDC) ; port RMII_MDC
NetU2_180: U11.16(TXEN) ; port RMII_TX_EN
NetU2_182: U11.17(TXD0) ; port RMII_TXD0
NetU2_183: U11.18(TXD1) ; port RMII_TXD1

Not connected (* = marked no-connect by the designer): DD1 6(CBUS0) 8(#RTS) 11(#CTS); DD2 1(NC)*; J6 4*; J7 1 4 6 7 8 9; J15 3 4; T1 5(TD2+)* 6(TD2-)* 11(TD4+)* 12(TD4-)*

### Notes on the sheet
- PG11
- PG13
- PB13
- PC4
- PC5
- PA7
- PC1
- PA2
- PA1
- (in symbol AMPHENOL_RJHSE-5381) LED1; Green; LED2; Yellow

### Library data of the parts
C61-C84 C86 = Capacitor_ST: Capacitor 0402 / 0603 / 0805; Revision: July-2002: Re-released for DXP Platform.
  C61-C79 C81-C84 C86: Value: 100nF
  C80: Value: 1uF
C85 = Cap_10uF_POL_10%_TANA: as C43 on sheet MCU_hall_crossboard_1_1; Revision: July-2002: Re-released for DXP Platform.; Value: 10uF; Manuf_1: VISHAY; Order: *; ECCN_US/EU: n/a
CR1 = USBUF02W6: USB protection; Mfr_Name: STMicroelectronics; RefDes: RefDes; Type: Type
D4 D5 = Bridge Rectifier 1+ 2AC 3- 4AC
D9 = RB521S-30: Чип Шоттки диод; Vendor: CTK; Voltage: 30V; SMD Solders: 2; Solder Option: RM; Pkg: SOD523; Price: 5; Device: RB521S-30; Name to order: RB521S-30
DD1 = FT234XD: USB-UART driver; Vendor: FTDI; SMD Solders: 7; THD Solders: 0; Device: FT234XD; Package: DFN_12-0.45; Unit Price: 2
DD2 = ADM3251: Driver UART-RS232; Vendor: Analog Devices; SMD Solder: 20; THD Solder: 0; Unit_Price: 1200; Device: ADM3251; Unit Price: 6; Package: SOICW20; SolderOption: 0
J6 = USB_mini: Вилка  PLS 6x2.54; Vendor: TE Connectivity; SolderOption: Norm; Price: 50; Value: USB_mini
J7 = Connector 9 Female: Solder Option: 0; THD Solders: 11; SMD Solders: 0; Vendor: *; Value: *
J8 = AMPHENOL_RJHSE-5381: 1 Port, 8 Positions, CAT5 RJ45 Modular Connector With Yellow And Green LEDs
J15 J16 = WF4: as J2 on sheet main_hall_crossboard_1_1; Price: 20; Device: WF4
K = G6RN-112DC: General Purpose Relay SPST-NO _1 Form A_ 12VDC Coil Through Hole; MF: Omron Electronics; Value: *; Availability: Unavailable; Package: Custom Package Omron Electronics Inc.; Price: None; SnapEDA_Link: https://www.snapeda.com/parts/G6RN-1%2012DC/Omron%20Electronics%20Inc-EMC%20Div/view-part/490385/?ref=snap; MP: G6RN-1 12DC
L4 L6 = BLM21: as L1 on sheet main_hall_crossboard_1_1; Device: BLM21; Price: 10
L5 = Inductor: Value: 100uH; Published: 8-Jun-2000; Revision: July-2002: Re-released for DXP Platform.; Publisher: Altium Limited
R36 R37 R40 R48 R49 R51 R52 R55 = Resistor_ST: Resistor 0402 / 0603 / 0805; Value: 10K
R38 R41-R47 R50 R54 R56-R58 = Resistor_ST: Resistor 0402 / 0603 / 0805
  R38 R41-R43 R50 R54 R56-R58: Value: 1k
  R44-R47: Value: 50
R39 = Resistor_ST: Resistor; Value: 1K; Ordered by: Subcon; Published: 8-Jun-2000; Revision: July-2002: Re-released for DXP Platform.; Publisher: Altium Limited
R53 = Res_1K5_1%_0402: Resistor,1K5,0402,1%,YAGEO; Manuf_Part_1: RC0402FR-071K5L; Value: 1K5; Manuf_1: YAGEO; Order: RC0402FR-071K5L; ECCN_US/EU: n/a; Distrib: FARNELL
T1 = H5007NL: Isolation and Data Interface _Encapsulated_ Pulse Transformer 1CT:1CT Surface Mount; MP: H5007NL-T; MF: Pulse Electronics; Package: Pulse Electronics; SnapEDA_Link: https://www.snapeda.com/parts/H5007NL-T/Pulse%20Electronics%20Network/view-part/2770413/?ref=snap; Value: *; Availability: Unavailable; Price: None
U11 = LAN8742A-CZ-TR: LAN8742A-CZ-TR - Small Footprint RMII 10/100 Ethernet, Transceiver with HP Auto-MDIX and flexPWR Technology SQFN-24; Manuf_1: MICROCHIP; Order: LAN8742A-CZ-TR; Manuf_Part_1: LAN8742A-CZ-TR; Distrib: MICROCHIP
X1 = XTAL_5032: Crystal Oscillator; Published: 8-Jun-2000; LatestRevisionDate: 17-Jul-2002; LatestRevisionNote: Re-released for DXP Platform.; PackageReference: R38; Publisher: Altium Limited

## Sheet AD7768_hall_crossboard_1_1.SchDoc
size A4
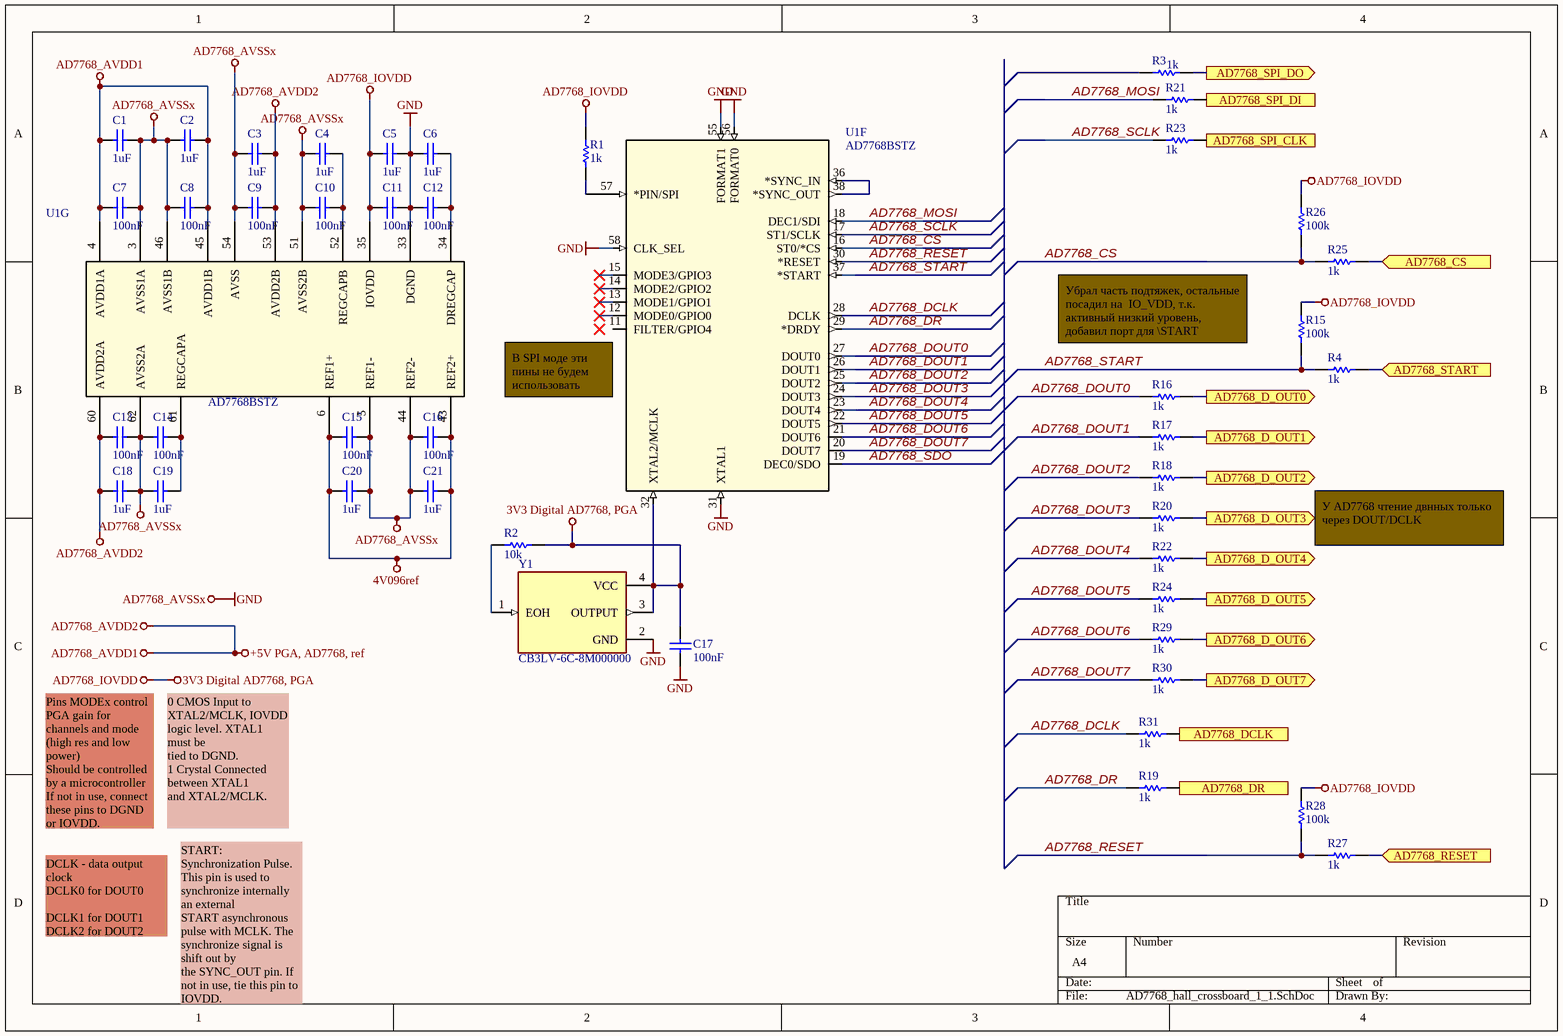
[diagram p3: AD7768_hall_crossboard_1_1.SchDoc]

### Parts
C1  1uF  [0805C]
C2  1uF  [0805C]
C3  1uF  [0805C]
C4  1uF  [0805C]
C5  1uF  [0805C]
C6  1uF  [0805C]
C7  100nF  [0603C]
C8  100nF  [0603C]
C9  100nF  [0603C]
C10  100nF  [0603C]
C11  100nF  [0603C]
C12  100nF  [0603C]
C13  100nF  [0603C]
C14  100nF  [0603C]
C15  100nF  [0603C]
C16  100nF  [0603C]
C17  100nF  [0603C]
C18  1uF  [0805C]
C19  1uF  [0805C]
C20  1uF  [0805C]
C21  1uF  [0805C]
R1  1k  [0603R]
R2  10k  [0603R]
R3  1k  [0603R]
R4  1k  [0603R]
R15  100k  [0603R]
R16  1k  [0603R]
R17  1k  [0603R]
R18  1k  [0603R]
R19  1k  [0603R]
R20  1k  [0603R]
R21  1k  [0603R]
R22  1k  [0603R]
R23  1k  [0603R]
R24  1k  [0603R]
R25  1k  [0603R]
R26  100k  [0603R]
R27  1k  [0603R]
R28  100k  [0603R]
R29  1k  [0603R]
R30  1k  [0603R]
R31  1k  [0603R]
U1  AD7768BSTZ  [ST-64-2_ADI-M]  (parts F,G of 7)
Y1  CB3LV-6C-8M000000  [OSC_CB3LV-6C-8M000000]

### Ports
AD7768_CS (in), AD7768_D_OUT0 (out), AD7768_D_OUT1 (out), AD7768_D_OUT2 (out), AD7768_D_OUT3 (out), AD7768_D_OUT4 (out), AD7768_D_OUT5 (out), AD7768_D_OUT6 (out), AD7768_D_OUT7 (out), AD7768_DCLK (out), AD7768_DR (out), AD7768_RESET (in), AD7768_SPI_CLK (in), AD7768_SPI_DI (in), AD7768_SPI_DO (out), AD7768_START (in)

### Nets
3V3 Digital AD7768, PGA: C5.2 C11.2 C17.2 R1.2 R2.2 R15.2 R26.2 R28.2 U1.32(XTAL2/MCLK) U1.35(IOVDD) Y1.3(OUTPUT) Y1.4(VCC)  [also labelled AD7768_IOVDD]
4V096ref: C15.1 C16.2 C20.1 C21.2 U1.6(REF1+) U1.43(REF2+)
+5V PGA, AD7768, ref: C1.1 C2.2 C3.2 C7.1 C8.2 C9.2 C13.1 C18.1 U1.4(AVDD1A) U1.45(AVDD1B) U1.53(AVDD2B) U1.60(AVDD2A)  [also labelled AD7768_AVDD1, AD7768_AVDD2]
AD7768_AVSSx: C1.2 C2.1 C3.1 C4.1 C5.1 C6.2 C7.2 C8.1 C9.1 C10.1 C11.1 C12.2 C13.2 C14.1 C15.2 C16.1 C17.1 C18.2 C19.1 C20.2 C21.1 U1.3(AVSS1A) U1.5(REF1-) U1.31(XTAL1) U1.33(DGND) U1.44(REF2-) U1.46(AVSS1B) U1.51(AVSS2B) U1.54(AVSS) U1.55(FORMAT1) U1.56(FORMAT0) U1.58(CLK_SEL) U1.62(AVSS2A) Y1.2(GND)  [also labelled GND]  [project net Pt_100+]
AD7768_CS: R25.1 R26.1 U1.16(ST0/*CS)
AD7768_DCLK: R31.2 ; port AD7768_DCLK
AD7768_DCLK: R31.1 U1.28(DCLK)  [a separate net that carries the same name]
AD7768_DOUT0: R16.1 U1.27(DOUT0)
AD7768_DOUT1: R17.1 U1.26(DOUT1)
AD7768_DOUT2: R18.1 U1.25(DOUT2)
AD7768_DOUT3: R20.1 U1.24(DOUT3)
AD7768_DOUT4: R22.1 U1.23(DOUT4)
AD7768_DOUT5: R24.1 U1.22(DOUT5)
AD7768_DOUT6: R29.1 U1.21(DOUT6)
AD7768_DOUT7: R30.1 U1.20(DOUT7)
AD7768_DR: R19.2 ; port AD7768_DR
AD7768_DR: R19.1 U1.29(*DRDY)  [a separate net that carries the same name]
AD7768_MOSI: R21.1 U1.18(DEC1/SDI)
AD7768_RESET: R27.2 ; port AD7768_RESET
AD7768_RESET: R27.1 R28.1 U1.30(*RESET)  [a separate net that carries the same name]
AD7768_SCLK: R23.1 U1.17(ST1/SCLK)
AD7768_SDO: U1.19(DEC0/SDO)
AD7768_START: R4.2 ; port AD7768_START
AD7768_START: R4.1 R15.1 U1.37(*START)  [a separate net that carries the same name]
MISO: R3.2 ; port AD7768_SPI_DO
MOSI: R21.2 ; port AD7768_SPI_DI
SCLK: R23.2 ; port AD7768_SPI_CLK
NetC4_2: C4.2 C10.2 U1.52(REGCAPB)
NetC6_1: C6.1 C12.1 U1.34(DREGCAP)
NetC14_2: C14.2 C19.2 U1.61(REGCAPA)
NetR1_1: R1.1 U1.57(*PIN/SPI)
NetR2_1: R2.1 Y1.1(EOH)
NetR16_2: R16.2 ; port AD7768_D_OUT0
NetR17_2: R17.2 ; port AD7768_D_OUT1
NetR18_2: R18.2 ; port AD7768_D_OUT2
NetR20_2: R20.2 ; port AD7768_D_OUT3
NetR22_2: R22.2 ; port AD7768_D_OUT4
NetR24_2: R24.2 ; port AD7768_D_OUT5
NetR25_2: R25.2 ; port AD7768_CS
NetR29_2: R29.2 ; port AD7768_D_OUT6
NetR30_2: R30.2 ; port AD7768_D_OUT7
NetU1_36: U1.36(*SYNC_IN) U1.38(*SYNC_OUT)

Not connected (* = marked no-connect by the designer): R3 1; U1 11(FILTER/GPIO4) 12(MODE0/GPIO0)* 13(MODE1/GPIO1)* 14(MODE2/GPIO2)* 15(MODE3/GPIO3)*

### Notes on the sheet
- Убрал часть подтяжек, остальные посадил на  IO_VDD, т.к. активный низкий уровень, добавил порт для \START
- (near U1) В SPI моде эти пины не будем использовать
- У AD7768 чтение двнных только через DOUT/DCLK
- Pins MODEx control PGA gain for channels and mode (high res and low power)
  Should be controlled by a microcontroller
  If not in use, connect these pins to DGND or IOVDD.
- 0 CMOS Input to XTAL2/MCLK, IOVDD
  logic level. XTAL1 must be
  tied to DGND.
  1 Crystal Connected between XTAL1
  and XTAL2/MCLK.
- DCLK - data output clock
  DCLK0 for DOUT0
  DCLK1 for DOUT1
  DCLK2 for DOUT2
- START: Synchronization Pulse. This pin is used to synchronize internally an external
  START asynchronous pulse with MCLK. The synchronize signal is shift out by
  the SYNC_OUT pin. If not in use, tie this pin to IOVDD.

### Library data of the parts
C1-C21 = Capacitor_ST: Capacitor 0402 / 0603 / 0805; Revision: July-2002: Re-released for DXP Platform.
  C1-C6 C18-C21: Value: 1uF
  C7-C17: Value: 100nF
R1-R4 R15-R31 = Resistor_ST: Resistor 0402 / 0603 / 0805
  R1 R3 R4 R16-R25 R27 R29-R31: Value: 1k
  R2: Value: 10k
  R15 R26 R28: Value: 100k
U1 = AD7768BSTZ: No Description Available; Mfr_Name: Analog Devices Inc; Type: Data Acquisition; RefDes: RefDes
Y1 = CB3LV-6C-8M000000: as Y2 on sheet MCU_hall_crossboard_1_1; SnapEDA_Link: https://www.snapeda.com/parts/CB3LV-6C-8M000000/CTS-Frequency+Controls/view-part/?ref=snap; Package: NON STANDARD-4 CTS; Value: *; MP: CB3LV-6C-8M000000; Check_prices: https://www.snapeda.com/parts/CB3LV-6C-8M000000/CTS-Frequency+Controls/view-part/?ref=eda

## Sheet st-link_v2_hall_crossboard_1_1.SchDoc
size A4
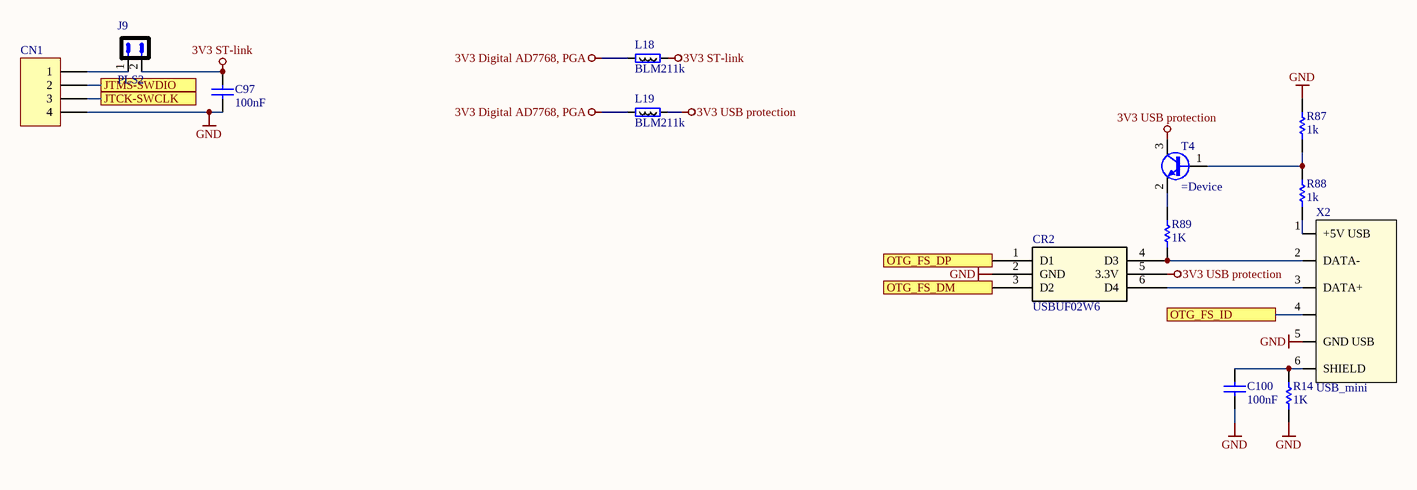
[diagram p4: st-link_v2_hall_crossboard_1_1.SchDoc]

### Parts
C97  100nF  [0603C]
C100  100nF  [0603C]
CN1  Header 4  [HDR_1x4_2R54_V_M]  (value not drawn)
CR2  USBUF02W6  [SOTT323-6L_STM-M]
J9  PLS2  [SAMTEC_TSW-102-23-L-S]
L18  BLM211k  [RESC2012X50N]
L19  BLM211k  [RESC2012X50N]
R14  1K  [0603R]
R87  1k  [0603R]
R88  1k  [0603R]
R89  1K  [0603R]
T4  (no value)  [SOT-23]
X2  USB_mini  [TYCO_1734035-1]

### Ports
JTCK-SWCLK, JTMS-SWDIO, OTG_FS_DM, OTG_FS_DP, OTG_FS_ID

### Nets
3V3 Digital AD7768, PGA: L18.2 L19.2
3V3 ST-link: C97.2 J9.2 L18.1
3V3 USB protection: CR2.5(3.3V) L19.1 T4.3(C)
GND: C97.1 C100.1 CN1.4 CR2.2(GND) R14.1 R87.2 X2.5(GND_USB)  [project net Pt_100+]
NetC100_2: C100.2 R14.2 X2.6(SHIELD)
NetCN1_1: CN1.1 J9.1
NetCN1_2: CN1.2 ; port JTMS-SWDIO
NetCN1_3: CN1.3 ; port JTCK-SWCLK
NetCR2_1: CR2.1(D1) ; port OTG_FS_DP
NetCR2_3: CR2.3(D2) ; port OTG_FS_DM
NetCR2_4: CR2.4(D3) R89.1 X2.2(DATA-)
NetCR2_6: CR2.6(D4) X2.3(DATA+)
NetR87_1: R87.1 R88.2 T4.1(B)
NetR88_1: R88.1 X2.1(+5V_USB)
NetR89_2: R89.2 T4.2(E)
NetU2_144: X2.4 ; port OTG_FS_ID

### Library data of the parts
C97 C100 = Capacitor_ST: Capacitor 0402 / 0603 / 0805; Revision: July-2002: Re-released for DXP Platform.; Value: 100nF
CN1 = Header 4: Header, 4-Pin, Single row; Revision: 17-Jul-2002: Re-released for DXP Platform.; Publisher: Altium Limited
CR2 = USBUF02W6: as CR1 on sheet POE_UART_hall_crossboard_1_1; RefDes: RefDes; Type: Type
J9 = PLS2: as J11 on sheet MCU_hall_crossboard_1_1; Price: 1; Device: PLS2
L18 L19 = BLM21: as L1 on sheet main_hall_crossboard_1_1; Device: BLM21; Price: 10
R14 R89 = Resistor_ST: Resistor 0402 / 0603 / 0805; Value: 10K
R87 R88 = Resistor_ST: Resistor 0402 / 0603 / 0805; Value: 1k
T4 = BC846: Bipolar transistor
X2 = USB_mini: as J6 on sheet POE_UART_hall_crossboard_1_1; Price: 50; Value: USB_mini

## Sheet SDRAM_hall_crossboard_1_1.SchDoc
size A4
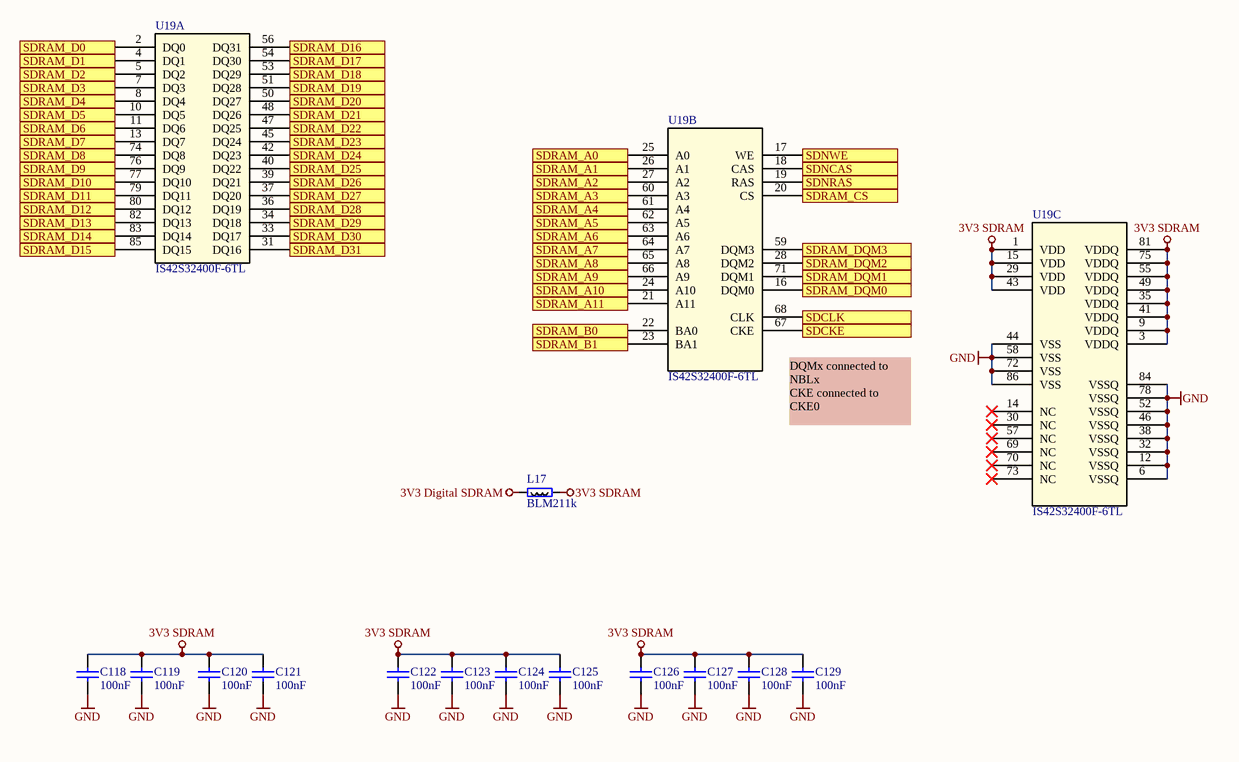
[diagram p5: SDRAM_hall_crossboard_1_1.SchDoc]

### Parts
C118  100nF  [0603C]
C119  100nF  [0603C]
C120  100nF  [0603C]
C121  100nF  [0603C]
C122  100nF  [0603C]
C123  100nF  [0603C]
C124  100nF  [0603C]
C125  100nF  [0603C]
C126  100nF  [0603C]
C127  100nF  [0603C]
C128  100nF  [0603C]
C129  100nF  [0603C]
L17  BLM211k  [RESC2012X50N]
U19  IS42S32400F-6TL  [SOP50P1176X120-86N]  (parts A,B,C of 3)

### Ports
SDCKE, SDCLK, SDNCAS, SDNRAS, SDNWE, SDRAM_A0, SDRAM_A1, SDRAM_A2, SDRAM_A3, SDRAM_A4, SDRAM_A5, SDRAM_A6, SDRAM_A7, SDRAM_A8, SDRAM_A9, SDRAM_A10, SDRAM_A11, SDRAM_B0, SDRAM_B1, SDRAM_CS, SDRAM_D0, SDRAM_D1, SDRAM_D2, SDRAM_D3, SDRAM_D4, SDRAM_D5, SDRAM_D6, SDRAM_D7, SDRAM_D8, SDRAM_D9, SDRAM_D10, SDRAM_D11, SDRAM_D12, SDRAM_D13, SDRAM_D14, SDRAM_D15, SDRAM_D16, SDRAM_D17, SDRAM_D18, SDRAM_D19, SDRAM_D20, SDRAM_D21, SDRAM_D22, SDRAM_D23, SDRAM_D24, SDRAM_D25, SDRAM_D26, SDRAM_D27, SDRAM_D28, SDRAM_D29, SDRAM_D30, SDRAM_D31, SDRAM_DQM0, SDRAM_DQM1, SDRAM_DQM2, SDRAM_DQM3

### Nets
3V3 Digital SDRAM: L17.1
3V3 SDRAM: C118.2 C119.2 C120.2 C121.2 C122.2 C123.2 C124.2 C125.2 C126.2 C127.2 C128.2 C129.1 L17.2 U19.1(VDD) U19.3(VDDQ) U19.9(VDDQ) U19.15(VDD) U19.29(VDD) U19.35(VDDQ) U19.41(VDDQ) U19.43(VDD) U19.49(VDDQ) U19.55(VDDQ) U19.75(VDDQ) U19.81(VDDQ)
GND: C118.1 C119.1 C120.1 C121.1 C122.1 C123.1 C124.1 C125.1 C126.1 C127.1 C128.1 C129.2 U19.6(VSSQ) U19.12(VSSQ) U19.32(VSSQ) U19.38(VSSQ) U19.44(VSS) U19.46(VSSQ) U19.52(VSSQ) U19.58(VSS) U19.72(VSS) U19.78(VSSQ) U19.84(VSSQ) U19.86(VSS)  [project net Pt_100+]
NetU2_35: U19.17(WE) ; port SDNWE
NetU2_46: U19.67(CKE) ; port SDCKE
NetU2_70: U19.19(RAS) ; port SDNRAS
NetU2_135: U19.68(CLK) ; port SDCLK
NetU2_177: U19.20(CS) ; port SDRAM_CS
NetU2_191: U19.18(CAS) ; port SDNCAS
NetU19_2: U19.2(DQ0) ; port SDRAM_D0
NetU19_4: U19.4(DQ1) ; port SDRAM_D1
NetU19_5: U19.5(DQ2) ; port SDRAM_D2
NetU19_7: U19.7(DQ3) ; port SDRAM_D3
NetU19_8: U19.8(DQ4) ; port SDRAM_D4
NetU19_10: U19.10(DQ5) ; port SDRAM_D5
NetU19_11: U19.11(DQ6) ; port SDRAM_D6
NetU19_13: U19.13(DQ7) ; port SDRAM_D7
NetU19_16: U19.16(DQM0) ; port SDRAM_DQM0
NetU19_21: U19.21(A11) ; port SDRAM_A11
NetU19_22: U19.22(BA0) ; port SDRAM_B0
NetU19_23: U19.23(BA1) ; port SDRAM_B1
NetU19_24: U19.24(A10) ; port SDRAM_A10
NetU19_25: U19.25(A0) ; port SDRAM_A0
NetU19_26: U19.26(A1) ; port SDRAM_A1
NetU19_27: U19.27(A2) ; port SDRAM_A2
NetU19_28: U19.28(DQM2) ; port SDRAM_DQM2
NetU19_31: U19.31(DQ16) ; port SDRAM_D31
NetU19_33: U19.33(DQ17) ; port SDRAM_D30
NetU19_34: U19.34(DQ18) ; port SDRAM_D29
NetU19_36: U19.36(DQ19) ; port SDRAM_D28
NetU19_37: U19.37(DQ20) ; port SDRAM_D27
NetU19_39: U19.39(DQ21) ; port SDRAM_D26
NetU19_40: U19.40(DQ22) ; port SDRAM_D25
NetU19_42: U19.42(DQ23) ; port SDRAM_D24
NetU19_45: U19.45(DQ24) ; port SDRAM_D23
NetU19_47: U19.47(DQ25) ; port SDRAM_D22
NetU19_48: U19.48(DQ26) ; port SDRAM_D21
NetU19_50: U19.50(DQ27) ; port SDRAM_D20
NetU19_51: U19.51(DQ28) ; port SDRAM_D19
NetU19_53: U19.53(DQ29) ; port SDRAM_D18
NetU19_54: U19.54(DQ30) ; port SDRAM_D17
NetU19_56: U19.56(DQ31) ; port SDRAM_D16
NetU19_59: U19.59(DQM3) ; port SDRAM_DQM3
NetU19_60: U19.60(A3) ; port SDRAM_A3
NetU19_61: U19.61(A4) ; port SDRAM_A4
NetU19_62: U19.62(A5) ; port SDRAM_A5
NetU19_63: U19.63(A6) ; port SDRAM_A6
NetU19_64: U19.64(A7) ; port SDRAM_A7
NetU19_65: U19.65(A8) ; port SDRAM_A8
NetU19_66: U19.66(A9) ; port SDRAM_A9
NetU19_71: U19.71(DQM1) ; port SDRAM_DQM1
NetU19_74: U19.74(DQ8) ; port SDRAM_D8
NetU19_76: U19.76(DQ9) ; port SDRAM_D9
NetU19_77: U19.77(DQ10) ; port SDRAM_D10
NetU19_79: U19.79(DQ11) ; port SDRAM_D11
NetU19_80: U19.80(DQ12) ; port SDRAM_D12
NetU19_82: U19.82(DQ13) ; port SDRAM_D13
NetU19_83: U19.83(DQ14) ; port SDRAM_D14
NetU19_85: U19.85(DQ15) ; port SDRAM_D15

Not connected (* = marked no-connect by the designer): U19 14(NC)* 30(NC)* 57(NC)* 69(NC)* 70(NC)* 73(NC)*

### Notes on the sheet
- (near U19) DQMx connected to NBLx
  CKE connected to CKE0

### Library data of the parts
C118-C129 = Capacitor_ST: Capacitor 0402 / 0603 / 0805; Revision: July-2002: Re-released for DXP Platform.; Value: 100nF
L17 = BLM21: as L1 on sheet main_hall_crossboard_1_1; Device: BLM21; Price: 10
U19 = IS42S32400F/IS45S32400F: 4M x 32 / 128Mb SYNCHRONOUS DRAM

## Sheet AD7768_inputs_hall_crossboard_1_1.SchDoc
size A4
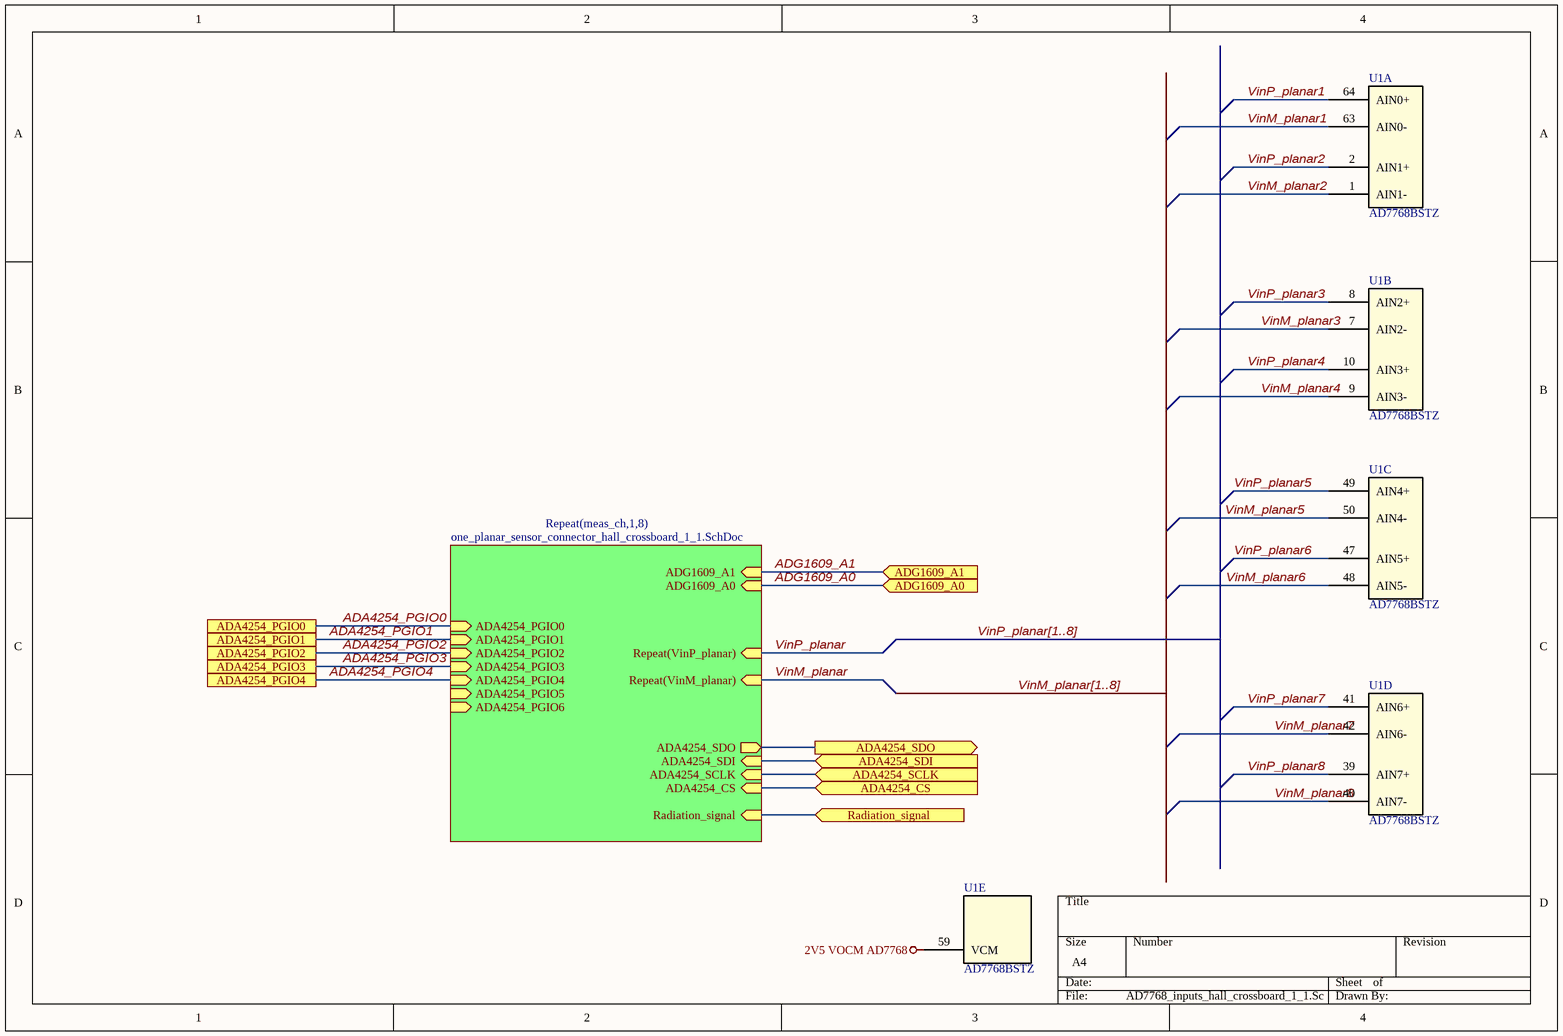
[diagram p6: AD7768_inputs_hall_crossboard_1_1.SchDoc]

### Parts
U1  AD7768BSTZ  [ST-64-2_ADI-M]  (parts A,B,C,D,E of 7)

### Sub-sheets
Repeat(meas_ch,1,8) = one_planar_sensor_connector_hall_crossboard_1_1.SchDoc: Repeat(VinP_planar) (in), Repeat(VinM_planar) (in), ADG1609_A0 (in), ADG1609_A1 (in), ADA4254_SDO (out), ADA4254_SDI (in), ADA4254_SCLK (in), ADA4254_CS (in), ADA4254_PGIO0 (in), ADA4254_PGIO1 (in), ADA4254_PGIO2 (in), ADA4254_PGIO3 (in), ADA4254_PGIO4 (in), ADA4254_PGIO5 (in), ADA4254_PGIO6 (in), Radiation_signal (in)

### Ports
ADA4254_CS (in), ADA4254_PGIO0, ADA4254_PGIO1, ADA4254_PGIO2, ADA4254_PGIO3, ADA4254_PGIO4, ADA4254_SCLK (in), ADA4254_SDI (in), ADA4254_SDO (out), ADG1609_A0 (in), ADG1609_A1 (in), Radiation_signal (in)

### Nets
2V5 VOCM AD7768: U1.59(VCM)
ADA4254_CS: port ADA4254_CS, sheet Repeat(meas_ch,1,8)/ADA4254_CS
ADA4254_PGIO0: port ADA4254_PGIO0, sheet Repeat(meas_ch,1,8)/ADA4254_PGIO0
ADA4254_PGIO1: port ADA4254_PGIO1, sheet Repeat(meas_ch,1,8)/ADA4254_PGIO1
ADA4254_PGIO2: port ADA4254_PGIO2, sheet Repeat(meas_ch,1,8)/ADA4254_PGIO2
ADA4254_PGIO3: port ADA4254_PGIO3, sheet Repeat(meas_ch,1,8)/ADA4254_PGIO3
ADA4254_PGIO4: port ADA4254_PGIO4, sheet Repeat(meas_ch,1,8)/ADA4254_PGIO4
ADG1609_A0: port ADG1609_A0, sheet Repeat(meas_ch,1,8)/ADG1609_A0
ADG1609_A1: port ADG1609_A1, sheet Repeat(meas_ch,1,8)/ADG1609_A1
MISO: port ADA4254_SDO, sheet Repeat(meas_ch,1,8)/ADA4254_SDO
MOSI: port ADA4254_SDI, sheet Repeat(meas_ch,1,8)/ADA4254_SDI
Radiation_signal: port Radiation_signal, sheet Repeat(meas_ch,1,8)/Radiation_signal
SCLK: port ADA4254_SCLK, sheet Repeat(meas_ch,1,8)/ADA4254_SCLK
VinM_planar: sheet Repeat(meas_ch,1,8)/Repeat(VinM_planar)
VinM_planar1: U1.63(AIN0-)
VinM_planar2: U1.1(AIN1-)
VinM_planar3: U1.7(AIN2-)
VinM_planar4: U1.9(AIN3-)
VinM_planar5: U1.50(AIN4-)
VinM_planar6: U1.48(AIN5-)
VinM_planar7: U1.42(AIN6-)
VinM_planar8: U1.40(AIN7-)
VinP_planar: sheet Repeat(meas_ch,1,8)/Repeat(VinP_planar)
VinP_planar1: U1.64(AIN0+)
VinP_planar2: U1.2(AIN1+)
VinP_planar3: U1.8(AIN2+)
VinP_planar4: U1.10(AIN3+)
VinP_planar5: U1.49(AIN4+)
VinP_planar6: U1.47(AIN5+)
VinP_planar7: U1.41(AIN6+)
VinP_planar8: U1.39(AIN7+)

### Buses and harness runs
bus VinM_planar[1..8]
bus VinP_planar[1..8]

### Library data of the parts
U1 = AD7768BSTZ: as U1 on sheet AD7768_hall_crossboard_1_1; Type: Data Acquisition; RefDes: RefDes